# EAGLE design elm2 (EAGLE 4.16)

## Sheet 1 of 4
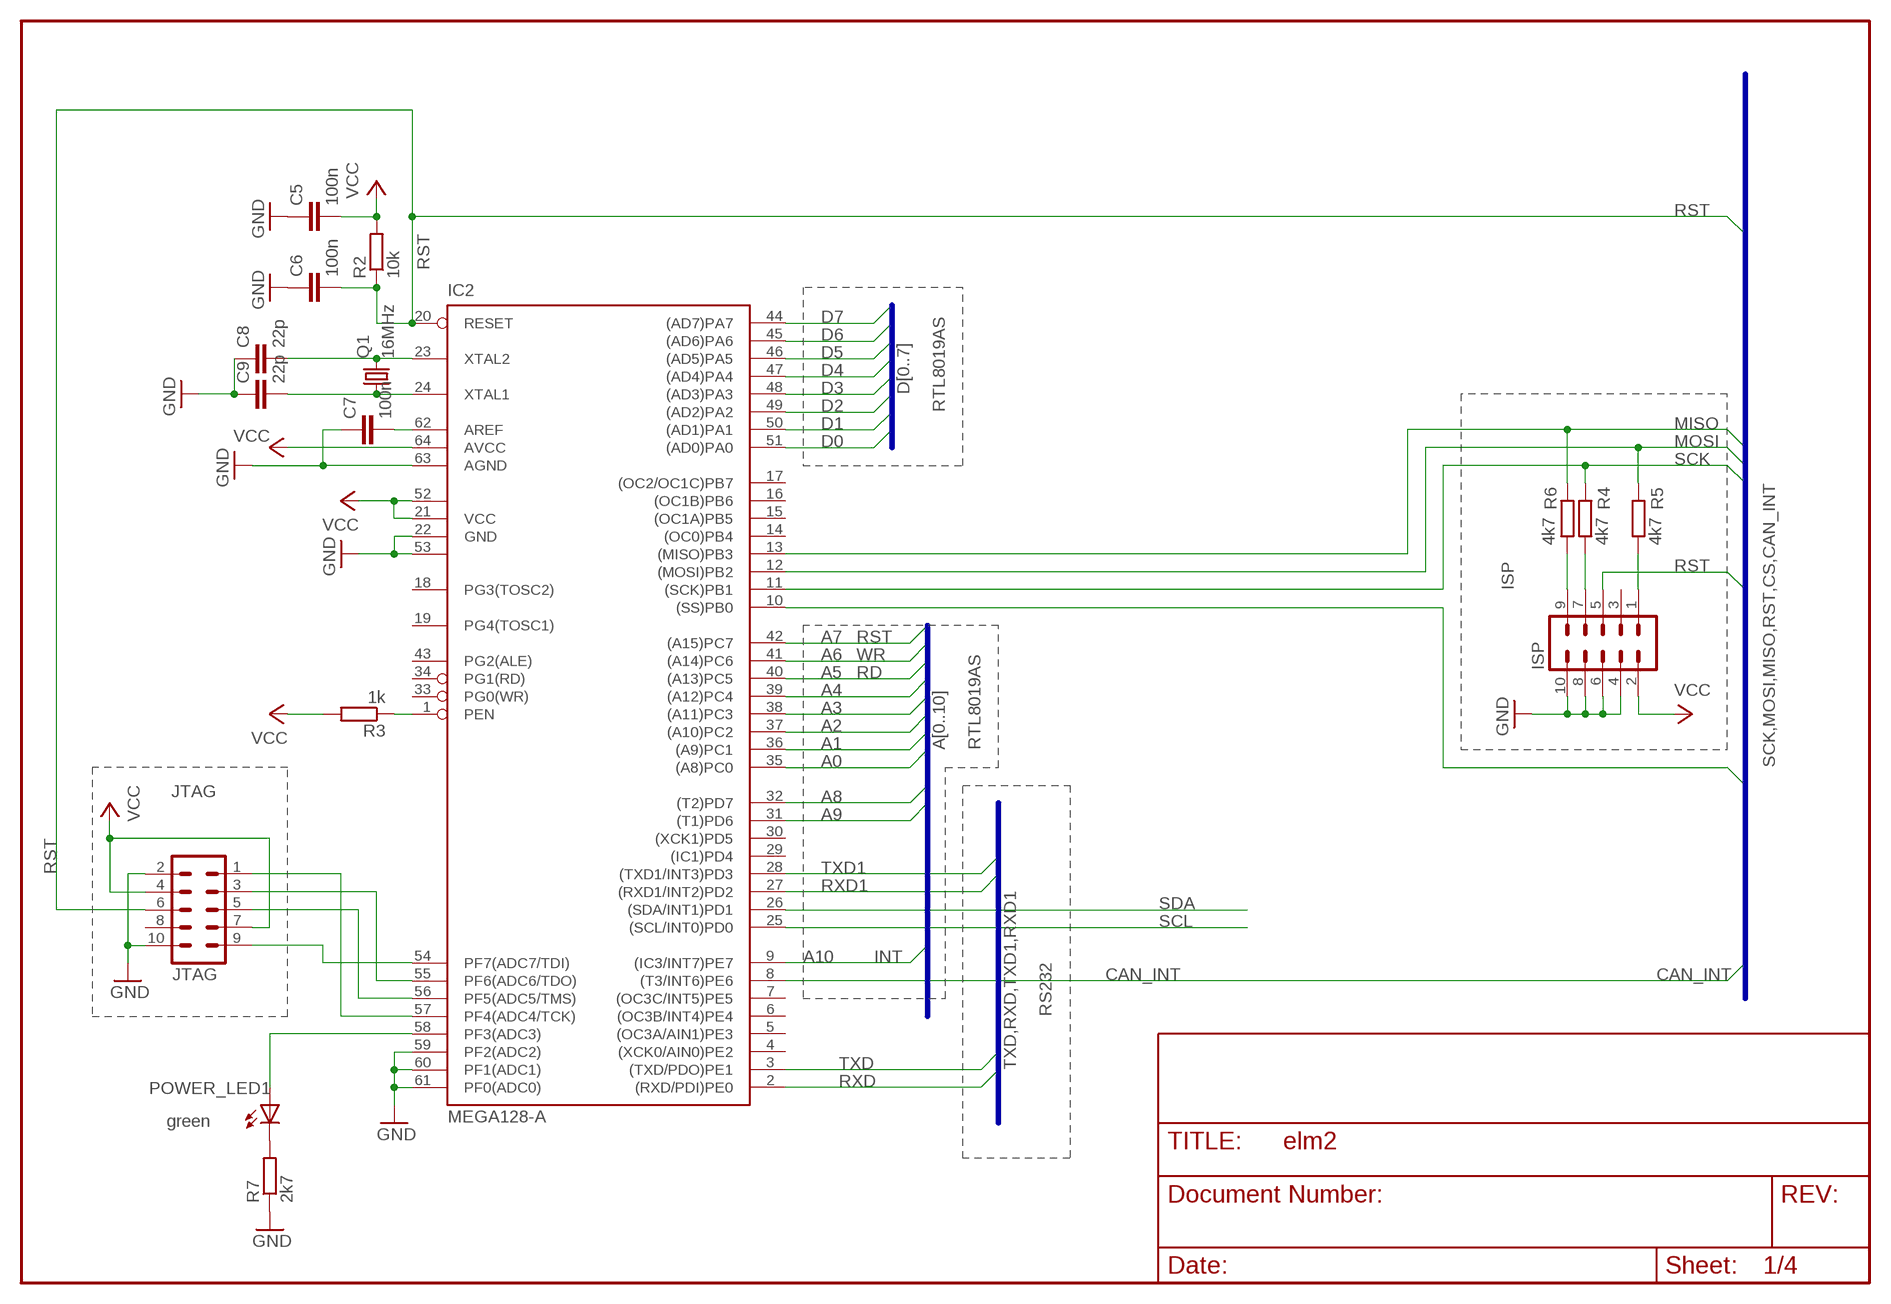
[diagram p0: schematic, sheet 1]

### Parts
C5  100n  C-EUC0603  [C0603]
C6  100n  C-EUC0603  [C0603]
C7  100n  C-EUC0603  [C0603]
C8  22p  C-EUC0603  [C0603]
C9  22p  C-EUC0603  [C0603]
IC2  MEGA128-A  [TQFP64]
ISP  MA05-2  [MA05-2]
JTAG  MA05-2  [MA05-2]
POWER_LED1  green  LED3MM  [LED3MM]
Q1  16MHz  CRYSTALHC49U-V  [HC49U-V]
R2  10k  R-EU_R0805  [R0805]
R3  1k  R-EU_R0805  [R0805]
R4  4k7  R-EU_R0805  [R0805]
R5  4k7  R-EU_R0805  [R0805]
R6  4k7  R-EU_R0805  [R0805]
R7  2k7  R-EU_R0805  [R0805]

### Nets
A0: IC2.35((A8)PC0) ; also sheet 3
A1: IC2.36((A9)PC1) ; also sheet 3
A2: IC2.37((A10)PC2) ; also sheet 3
A3: IC2.38((A11)PC3) ; also sheet 3
A4: IC2.39((A12)PC4) ; also sheet 3
A5: IC2.40((A13)PC5) ; also sheet 3
A6: IC2.41((A14)PC6) ; also sheet 3
A7: IC2.42((A15)PC7) ; also sheet 3
A8: IC2.32((T2)PD7) ; also sheet 3
A9: IC2.31((T1)PD6) ; also sheet 3
A10: IC2.9((IC3/INT7)PE7) ; also sheet 3
CAN_INT: IC2.8((T3/INT6)PE6) ; also sheet 2
CS: IC2.10((SS)PB0) ; also sheet 2
D0: IC2.51((AD0)PA0) ; also sheet 3
D1: IC2.50((AD1)PA1) ; also sheet 3
D2: IC2.49((AD2)PA2) ; also sheet 3
D3: IC2.48((AD3)PA3) ; also sheet 3
D4: IC2.47((AD4)PA4) ; also sheet 3
D5: IC2.46((AD5)PA5) ; also sheet 3
D6: IC2.45((AD6)PA6) ; also sheet 3
D7: IC2.44((AD7)PA7) ; also sheet 3
GND: C5.1 C6.1 C7.1 C8.1 C9.1 IC2.22(GND) IC2.53(GND1) IC2.59(PF2(ADC2)) IC2.60(PF1(ADC1)) IC2.61(PF0(ADC0)) IC2.63(AGND) ISP.4 ISP.6 ISP.8 ISP.10 JTAG.2 JTAG.10 R7.1 ; also sheet 2,3,4
MISO: IC2.13((MISO)PB3) R6.2 ; also sheet 2
MOSI: IC2.12((MOSI)PB2) R5.2 ; also sheet 2
N$5: C7.2 IC2.62(AREF)
N$6: C9.2 IC2.24(XTAL1) Q1.1
N$7: C8.2 IC2.23(XTAL2) Q1.2
N$22: ISP.9 R6.1
N$25: ISP.1 R5.1
N$26: IC2.1(PEN) R3.1
N$29: ISP.7 R4.1
N$31: POWER_LED1.K(C) R7.2
N$32: IC2.58(PF3(ADC3)) POWER_LED1.A
N$68: IC2.54(PF7(ADC7/TDI)) JTAG.9
N$69: IC2.55(PF6(ADC6/TDO)) JTAG.3
N$70: IC2.56(PF5(ADC5/TMS)) JTAG.5
N$71: IC2.57(PF4(ADC4/TCK)) JTAG.1
RST: C6.2 IC2.20(RESET) ISP.5 JTAG.6 R2.1 ; also sheet 2,4
RXD: IC2.2((RXD/PDI)PE0) ; also sheet 4
RXD1: IC2.27((RXD1/INT2)PD2) ; also sheet 4
SCK: IC2.11((SCK)PB1) R4.2 ; also sheet 2
SCL: IC2.25((SCL/INT0)PD0) ; also sheet 4
SDA: IC2.26((SDA/INT1)PD1) ; also sheet 4
TXD: IC2.3((TXD/PDO)PE1) ; also sheet 4
TXD1: IC2.28((TXD1/INT3)PD3) ; also sheet 4
VCC: C5.2 IC2.21(VCC) IC2.52(VCC1) IC2.64(AVCC) ISP.2 JTAG.4 JTAG.7 R2.2 R3.2 ; also sheet 2,3,4
Unconnected: IC2.4((XCK0/AIN0)PE2) IC2.5((OC3A/AIN1)PE3) IC2.6((OC3B/INT4)PE4) IC2.7((OC3C/INT5)PE5) IC2.14((OC0)PB4) IC2.15((OC1A)PB5) IC2.16((OC1B)PB6) IC2.17((OC2/OC1C)PB7) IC2.18(PG3(TOSC2)) IC2.19(PG4(TOSC1)) IC2.29((IC1)PD4) IC2.30((XCK1)PD5) IC2.33(PG0(WR)) IC2.34(PG1(RD)) IC2.43(PG2(ALE)) ISP.3 JTAG.8

### Buses
SCK,MOSI,MISO,RST,CS,CAN_INT
TXD,RXD,TXD1,RXD1
D[0..7]
A[0..10]

### Notes on the sheet
- RTL8019AS
- ISP
- RST
- WR
- RD
- RTL8019AS
- JTAG
- INT
- RS232

## Sheet 2 of 4
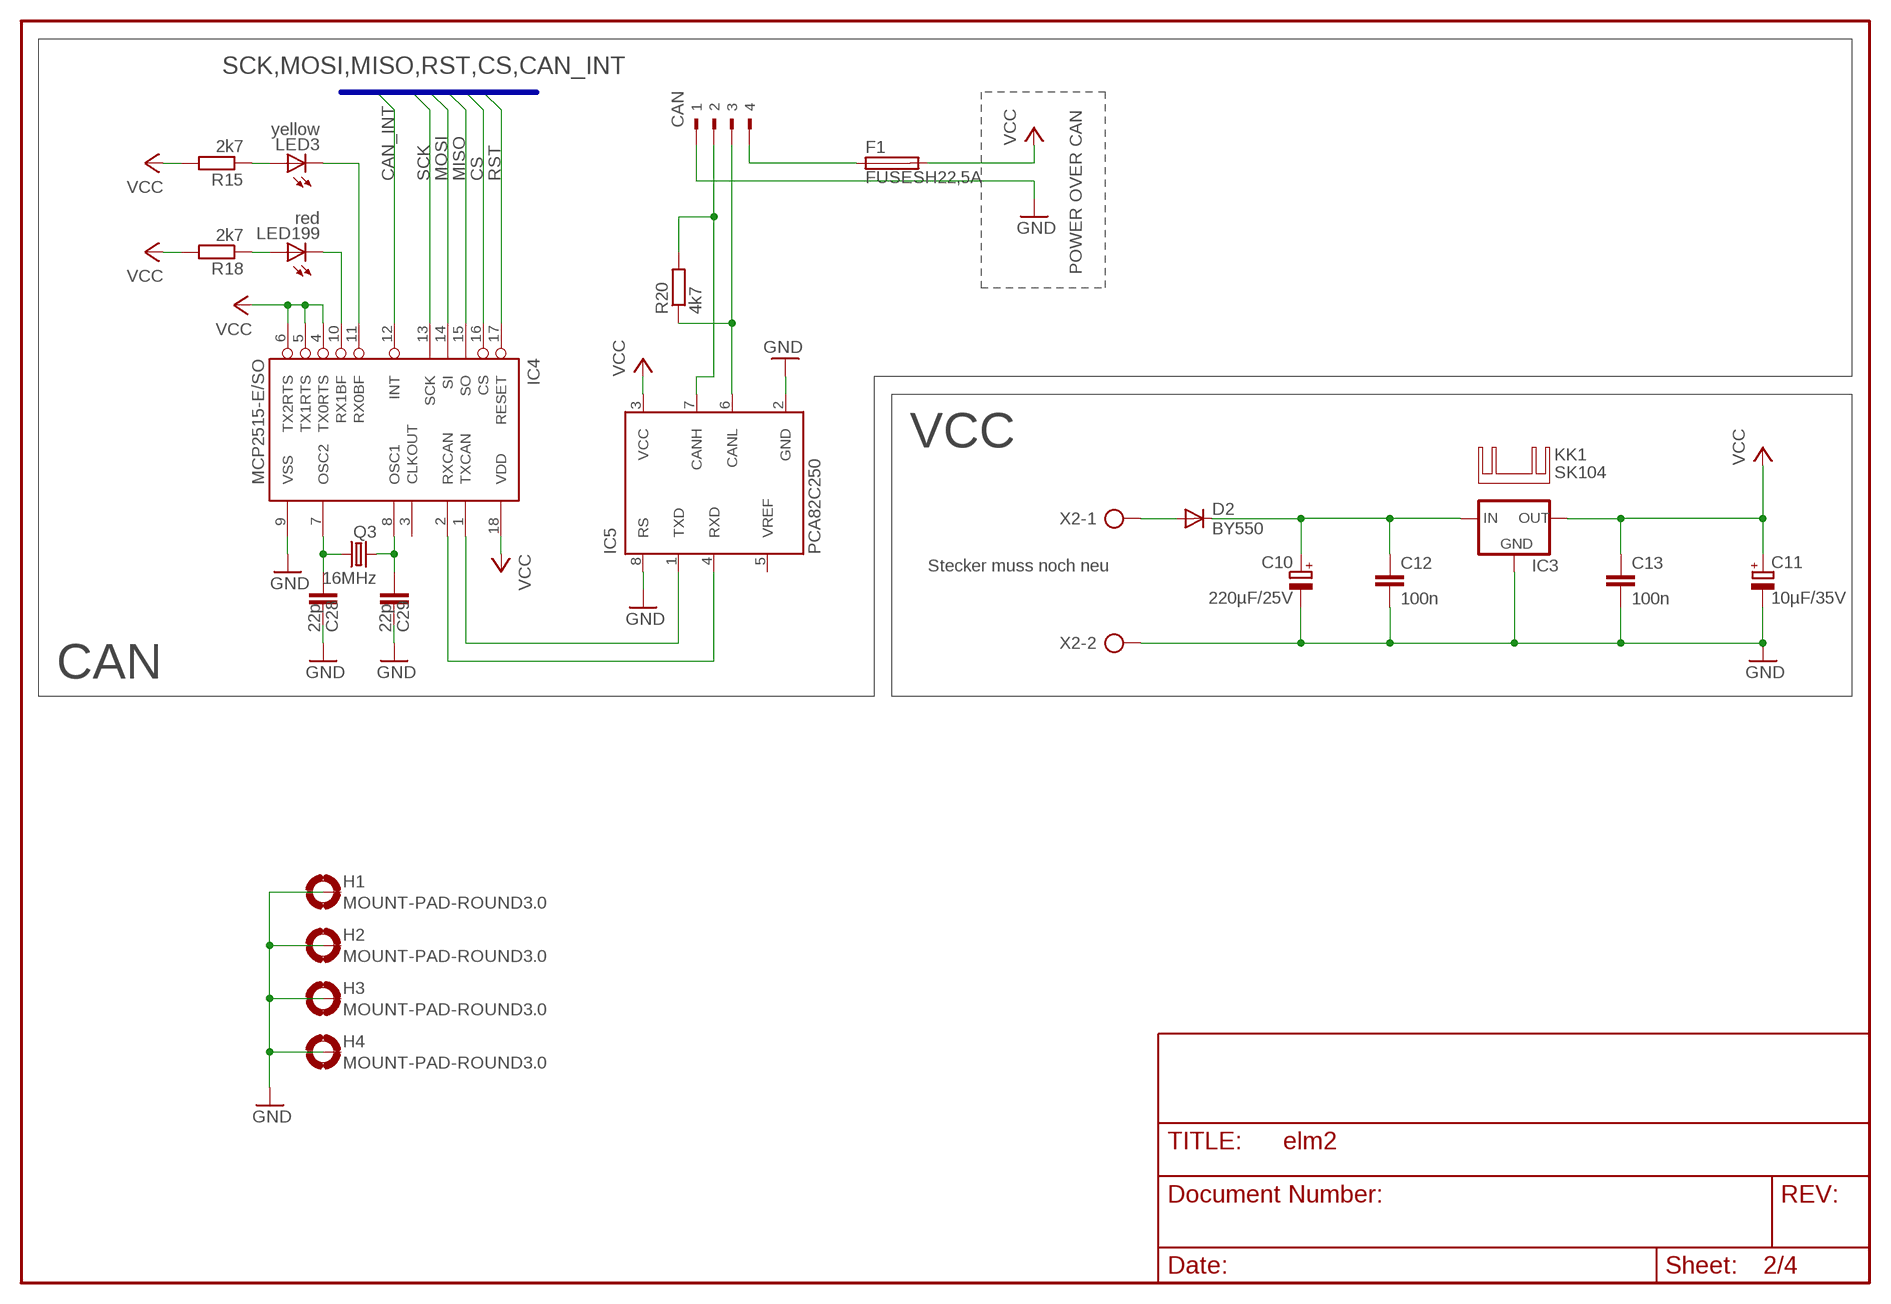
[diagram p1: schematic, sheet 2]

### Parts
C10  220µF/25V  CPOL-EUE3.5-8  [E3,5-8]
C11  10µF/35V  CPOL-EUE2-5  [E2-5]
C12  100n  C-EUC0603  [C0603]
C13  100n  C-EUC0603  [C0603]
C28  22p  C-EUC0603  [C0603]
C29  22p  C-EUC0603  [C0603]
CAN  90-4  [90-4]
D2  BY550  [DO27-15]
F1  FUSESH22,5A  [SH22,5A]
H1  MOUNT-PAD-ROUND3.0  [3,0-PAD]
H2  MOUNT-PAD-ROUND3.0  [3,0-PAD]
H3  MOUNT-PAD-ROUND3.0  [3,0-PAD]
H4  MOUNT-PAD-ROUND3.0  [3,0-PAD]
IC3  78XXS  [78XXS]
IC4  MCP2515-E/SO  [SO18L]
IC5  PCA82C250  [DIL08]
KK1  SK104  [SK104]
LED3  yellow  LED3MM  [LED3MM]
LED199  red  LED3MM  [LED3MM]
Q3  16MHz  CRYSTALHC49U-V  [HC49U-V]
R15  2k7  R-EU_R0805  [R0805]
R18  2k7  R-EU_R0805  [R0805]
R20  4k7  R-EU_R0805  [R0805]
X2  AK500/2-H  [AK500/2-H]

### Nets
CAN_INT: IC4.12(INT) ; also sheet 1
CS: IC4.16(CS) ; also sheet 1
GND: C10.- C11.- C12.2 C13.2 C28.2 C29.2 CAN.1 H1.B3,0(MOUNT) H2.B3,0(MOUNT) H3.B3,0(MOUNT) H4.B3,0(MOUNT) IC3.GND IC4.9(VSS) IC5.2(GND) IC5.8(RS) X2.2 ; also sheet 1,3,4
MISO: IC4.15(SO) ; also sheet 1
MOSI: IC4.14(SI) ; also sheet 1
N$2: IC4.1(TXCAN) IC5.1(TXD)
N$8: C10.+ C12.1 D2.C IC3.IN
N$10: D2.A X2.1
N$16: CAN.4 F1.1
N$21: IC4.2(RXCAN) IC5.4(RXD)
N$23: CAN.3 IC5.6(CANL) R20.1
N$27: IC4.11(RX0BF) LED3.K(C)
N$38: IC4.10(RX1BF) LED199.K(C)
N$48: LED3.A R15.1
N$52: LED199.A R18.1
N$53: C28.1 IC4.7(OSC2) Q3.1
N$54: C29.1 IC4.8(OSC1) Q3.2
N$59: CAN.2 IC5.7(CANH) R20.2
RST: IC4.17(RESET) ; also sheet 1,4
SCK: IC4.13(SCK) ; also sheet 1
VCC: C11.+ C13.1 F1.2 IC3.OUT IC4.4(TX0RTS) IC4.5(TX1RTS) IC4.6(TX2RTS) IC4.18(VDD) IC5.3(VCC) R15.2 R18.2 ; also sheet 1,3,4
Unconnected: IC4.3(CLKOUT) IC5.5(VREF)

### Buses
SCK,MOSI,MISO,RST,CS,CAN_INT

### Notes on the sheet
- POWER OVER CAN
- VCC
- Stecker muss noch neu
- CAN

## Sheet 3 of 4
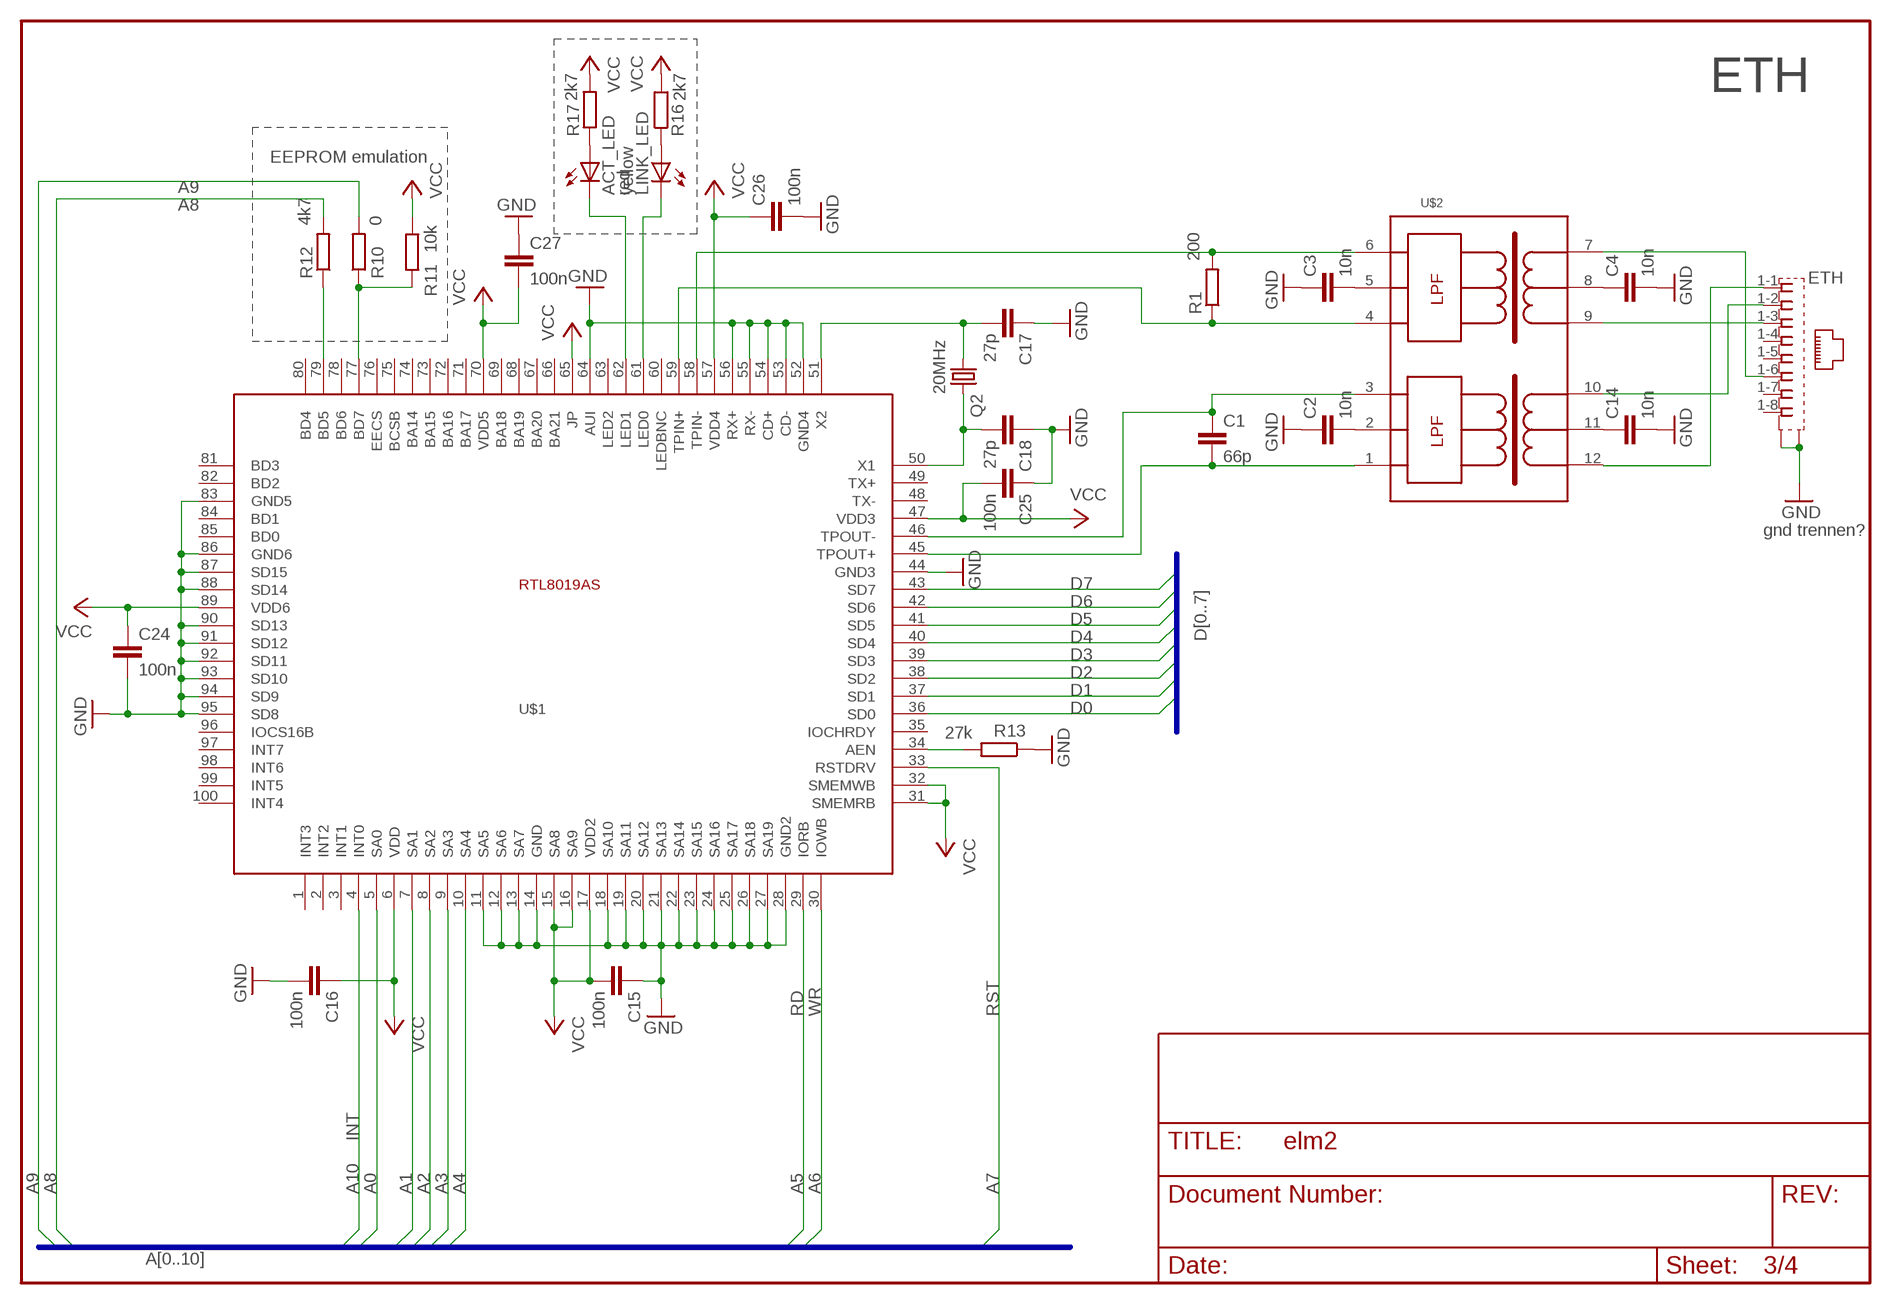
[diagram p2: schematic, sheet 3]

### Parts
ACT_LED  red  LED3MM  [LED3MM]
C1  66p  C-EUC0603  [C0603]
C2  10n  C-EUC0603  [C0603]
C3  10n  C-EUC0603  [C0603]
C4  10n  C-EUC0603  [C0603]
C14  10n  C-EUC0603  [C0603]
C15  100n  C-EUC0603  [C0603]
C16  100n  C-EUC0603  [C0603]
C17  27p  C-EUC0603  [C0603]
C18  27p  C-EUC0603  [C0603]
C24  100n  C-EUC0603  [C0603]
C25  100n  C-EUC0603  [C0603]
C26  100n  C-EUC0603  [C0603]
C27  100n  C-EUC0603  [C0603]
ETH  557786-1  [557786-1]
LINK_LED  yellow  LED3MM  [LED3MM]
Q2  20MHz  CRYSTALHC49U-V  [HC49U-V]
R1  200  R-EU_R0805  [R0805]
R10  0  R-EU_R0805  [R0805]
R11  10k  R-EU_R0805  [R0805]
R12  4k7  R-EU_R0805  [R0805]
R13  27k  R-EU_R0805  [R0805]
R16  2k7  R-EU_R0805  [R0805]
R17  2k7  R-EU_R0805  [R0805]
U$1  RTL8019AS  [RTL8019AS]
U$2  20F001  [DIL16/12]

### Nets
A0: U$1.5(SA0) ; also sheet 1
A1: U$1.7(SA1) ; also sheet 1
A2: U$1.8(SA2) ; also sheet 1
A3: U$1.9(SA3) ; also sheet 1
A4: U$1.10(SA4) ; also sheet 1
A5: U$1.29(IORB) ; also sheet 1
A6: U$1.30(IOWB) ; also sheet 1
A7: U$1.33(RSTDRV) ; also sheet 1
A8: R12.2 ; also sheet 1
A9: R10.2 ; also sheet 1
A10: U$1.4(INT0) ; also sheet 1
D0: U$1.36(SD0) ; also sheet 1
D1: U$1.37(SD1) ; also sheet 1
D2: U$1.38(SD2) ; also sheet 1
D3: U$1.39(SD3) ; also sheet 1
D4: U$1.40(SD4) ; also sheet 1
D5: U$1.41(SD5) ; also sheet 1
D6: U$1.42(SD6) ; also sheet 1
D7: U$1.43(SD7) ; also sheet 1
GND: C2.1 C3.1 C4.2 C14.2 C15.1 C16.2 C17.1 C18.1 C24.2 C25.1 C26.2 C27.1 ETH.G1(S2) ETH.G2(S1) R13.1 U$1.11(SA5) U$1.12(SA6) U$1.13(SA7) U$1.14(GND) U$1.18(SA10) U$1.19(SA11) U$1.20(SA12) U$1.21(SA13) U$1.22(SA14) U$1.23(SA15) U$1.24(SA16) U$1.25(SA17) U$1.26(SA18) U$1.27(SA19) U$1.28(GND2) U$1.44(GND3) U$1.52(GND4) U$1.53(CD-) U$1.54(CD+) U$1.55(RX-) U$1.56(RX+) U$1.64(AUI) U$1.83(GND5) U$1.86(GND6) U$1.87(SD15) U$1.88(SD14) U$1.90(SD13) U$1.91(SD12) U$1.92(SD11) U$1.93(SD10) U$1.94(SD9) U$1.95(SD8) ; also sheet 1,2,4
N$1: R1.2 U$1.58(TPIN-) U$2.6
N$3: R1.1 U$1.59(TPIN+) U$2.4
N$4: C1.1 U$1.46(TPOUT-) U$2.3
N$11: C1.2 U$1.45(TPOUT+) U$2.1
N$12: C3.2 U$2.5
N$13: C2.2 U$2.2
N$14: C14.1 U$2.11
N$15: C4.1 U$2.8
N$18: ETH.1-1 U$2.12
N$19: ETH.1-2 U$2.10
N$20: ETH.1-3 U$2.9
N$24: ETH.1-6 U$2.7
N$28: LINK_LED.A R16.1
N$34: C17.2 Q2.2 U$1.51(X2)
N$35: C18.2 Q2.1 U$1.50(X1)
N$36: R10.1 R11.2 U$1.77(BD7)
N$37: R12.1 U$1.79(BD5)
N$39: R13.2 U$1.34(AEN)
N$44: ACT_LED.A R17.1
N$45: LINK_LED.K(C) U$1.61(LED0)
N$47: ACT_LED.K(C) U$1.62(LED1)
VCC: C15.2 C16.1 C24.1 C25.2 C26.1 C27.2 R11.1 R16.2 R17.2 U$1.6(VDD) U$1.15(SA8) U$1.16(SA9) U$1.17(VDD2) U$1.31(SMEMRB) U$1.32(SMEMWB) U$1.47(VDD3) U$1.57(VDD4) U$1.65(JP) U$1.70(VDD5) U$1.89(VDD6) ; also sheet 1,2,4
Unconnected: ETH.1-4 ETH.1-5 ETH.1-7 ETH.1-8 U$1.1(INT3) U$1.2(INT2) U$1.3(INT1) U$1.35(IOCHRDY) U$1.48(TX-) U$1.49(TX+) U$1.60(LEDBNC) U$1.63(LED2) U$1.66(BA21) U$1.67(BA20) U$1.68(BA19) U$1.69(BA18) U$1.71(BA17) U$1.72(BA16) U$1.73(BA15) U$1.74(BA14) U$1.75(BCSB) U$1.76(EECS) U$1.78(BD6) U$1.80(BD4) U$1.81(BD3) U$1.82(BD2) U$1.84(BD1) U$1.85(BD0) U$1.96(IOCS16B) U$1.97(INT7) U$1.98(INT6) U$1.99(INT5) U$1.100(INT4)

### Buses
D[0..7]
A[0..10]

### Notes on the sheet
- ETH
- EEPROM emulation
- gnd trennen?
- RD | WR | RST
- INT

## Sheet 4 of 4
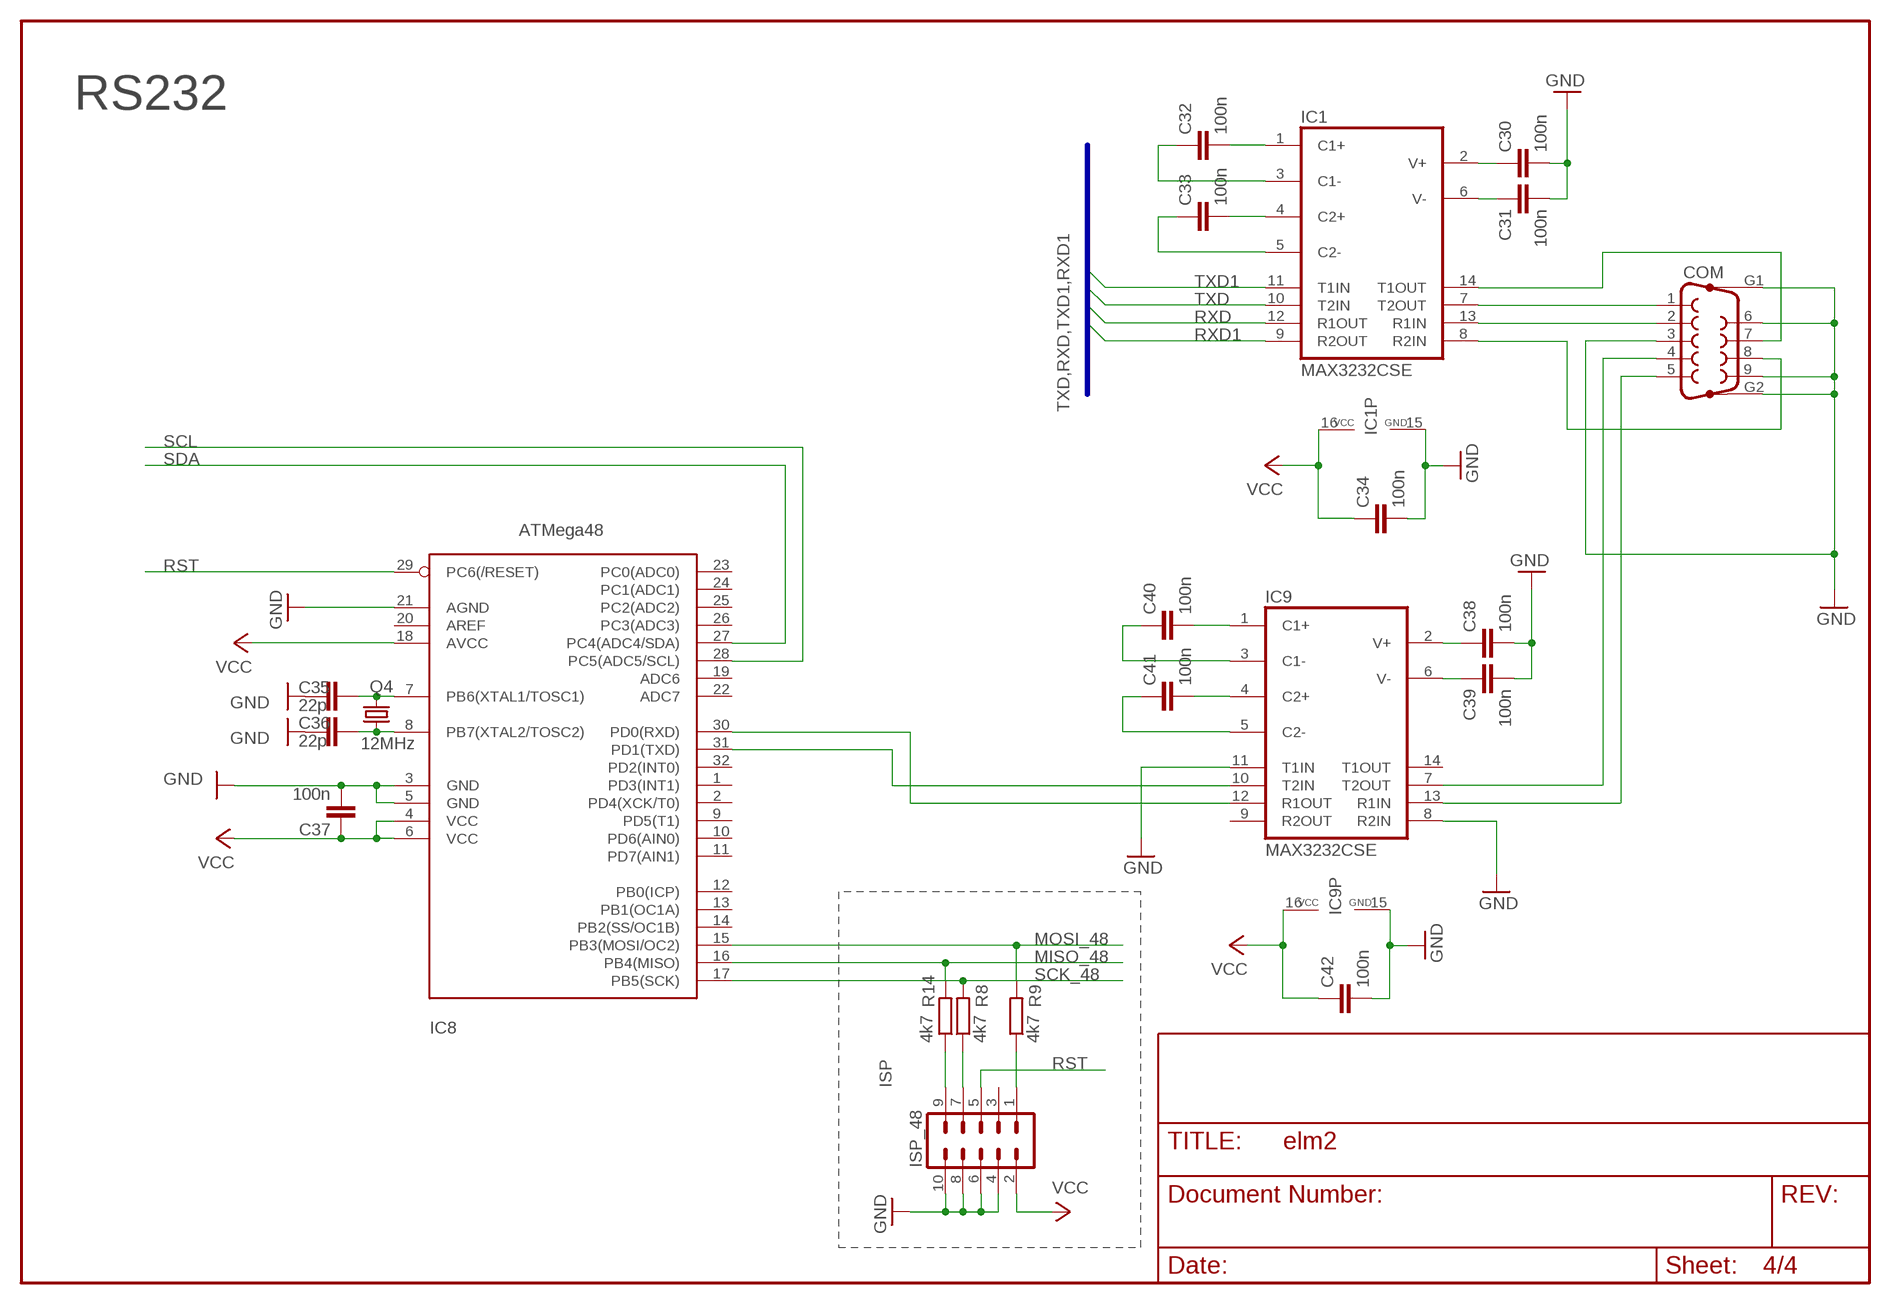
[diagram p3: schematic, sheet 4]

### Parts
C30  100n  C-EUC0603  [C0603]
C31  100n  C-EUC0603  [C0603]
C32  100n  C-EUC0603  [C0603]
C33  100n  C-EUC0603  [C0603]
C34  100n  C-EUC0603  [C0603]
C35  22p  C-EUC0603  [C0603]
C36  22p  C-EUC0603  [C0603]
C37  100n  C-EUC0603  [C0603]
C38  100n  C-EUC0603  [C0603]
C39  100n  C-EUC0603  [C0603]
C40  100n  C-EUC0603  [C0603]
C41  100n  C-EUC0603  [C0603]
C42  100n  C-EUC0603  [C0603]
COM  F09HP  [F09HP]
IC1  MAX3232CSE  [SO16]
IC8  ATMega48  MEGA8-AI  [TQFP32-08]
IC9  MAX3232CSE  [SO16]
ISP_48  MA05-2  [MA05-2]
Q4  12MHz  CRYTALHC49S  [HC49/S]
R8  4k7  R-EU_R0805  [R0805]
R9  4k7  R-EU_R0805  [R0805]
R14  4k7  R-EU_R0805  [R0805]

### Nets
GND: C30.2 C31.2 C34.2 C35.1 C36.2 C37.2 C38.2 C39.2 C42.2 COM.3 COM.6 COM.9 COM.G1 COM.G2 IC1.15(GND) IC8.3(GND) IC8.5(GND) IC8.21(AGND) IC9.8(R2IN) IC9.11(T1IN) IC9.15(GND) ISP_48.4 ISP_48.6 ISP_48.8 ISP_48.10 ; also sheet 1,2,3
MISO_48: IC8.16(PB4(MISO)) R14.2
MOSI_48: IC8.15(PB3(MOSI/OC2)) R9.2
N$9: COM.1 IC1.7(T2OUT)
N$17: ISP_48.9 R14.1
N$30: ISP_48.1 R9.1
N$33: COM.2 IC1.13(R1IN)
N$40: ISP_48.7 R8.1
N$60: C32.2 IC1.1(C1+)
N$61: C33.2 IC1.4(C2+)
N$72: C33.1 IC1.5(C2-)
N$73: C32.1 IC1.3(C1-)
N$74: COM.7 IC1.14(T1OUT)
N$75: COM.8 IC1.8(R2IN)
N$76: C30.1 IC1.2(V+)
N$77: C31.1 IC1.6(V-)
N$78: COM.4 IC9.7(T2OUT)
N$79: C35.2 IC8.7(PB6(XTAL1/TOSC1)) Q4.2
N$80: C36.1 IC8.8(PB7(XTAL2/TOSC2)) Q4.1
N$82: COM.5 IC9.13(R1IN)
N$83: C40.2 IC9.1(C1+)
N$84: C41.2 IC9.4(C2+)
N$85: C41.1 IC9.5(C2-)
N$86: C40.1 IC9.3(C1-)
N$87: IC8.30(PD0(RXD)) IC9.12(R1OUT)
N$88: IC8.31(PD1(TXD)) IC9.10(T2IN)
N$89: C38.1 IC9.2(V+)
N$90: C39.1 IC9.6(V-)
RST: IC8.29(PC6(/RESET)) ISP_48.5 ; also sheet 1,2
RXD: IC1.12(R1OUT) ; also sheet 1
RXD1: IC1.9(R2OUT) ; also sheet 1
SCK_48: IC8.17(PB5(SCK)) R8.2
SCL: IC8.28(PC5(ADC5/SCL)) ; also sheet 1
SDA: IC8.27(PC4(ADC4/SDA)) ; also sheet 1
TXD: IC1.10(T2IN) ; also sheet 1
TXD1: IC1.11(T1IN) ; also sheet 1
VCC: C34.1 C37.1 C42.1 IC1.16(VCC) IC8.4(VCC) IC8.6(VCC) IC8.18(AVCC) IC9.16(VCC) ISP_48.2 ; also sheet 1,2,3
Unconnected: IC8.1(PD3(INT1)) IC8.2(PD4(XCK/T0)) IC8.9(PD5(T1)) IC8.10(PD6(AIN0)) IC8.11(PD7(AIN1)) IC8.12(PB0(ICP)) IC8.13(PB1(OC1A)) IC8.14(PB2(SS/OC1B)) IC8.19(ADC6) IC8.20(AREF) IC8.22(ADC7) IC8.23(PC0(ADC0)) IC8.24(PC1(ADC1)) IC8.25(PC2(ADC2)) IC8.26(PC3(ADC3)) IC8.32(PD2(INT0)) IC9.9(R2OUT) IC9.14(T1OUT) ISP_48.3

### Buses
TXD,RXD,TXD1,RXD1

### Notes on the sheet
- RS232
- ISP

## Library data of the parts
ACT_LED LED3 LED199 LINK_LED POWER_LED1 = led:LED: LED OSRAM: - CHIPLED LG R971, LG N971, LY N971, LG Q971, LY Q971, LO R971, LY R971 LH N974, LH R974 LS Q976, LO Q976, LY Q976 LO Q996 - Hyper CHIPLED LW Q18S LB Q993, LB Q99A, LB R99A - SideLED LS A670, LO A670, LY A670, LG A670, LP A670 LB A673, LV A673, LT A673, LW A673 LH A674 LY A675 LS A676, LA A676, LO A676, LY A676, LW A676 LS A679, LY A679, LG A679 - Hyper Micro SIDELED® LS Y876, LA Y876, LO Y876, LY Y876 LT Y87S - SmartLED LW L88C, LW L88S LB L89C, LB L89S, LG L890 LS L89K, LO L89K, LY L89K LS L896, LA L896, LO L896, LY L896 - TOPLED LS T670, LO T670, LY T670, LG T670, LP T670 LSG T670, LSP T670, LSY T670, LOP T670, LYG T670 LG T671, LOG T671, LSG T671 LB T673, LV T673, LT T673, LW T673 LH T674 LS T676, LA T676, LO T676, LY T676, LB T676, LH T676, LSB T676, LW T676 LB T67C, LV T67C, LT T67C, LS T67K, LO T67K, LY T67K, LW E67C LS E67B, LA E67B, LO E67B, LY E67B, LB E67C, LV E67C, LT E67C LW T67C LS T679, LY T679, LG T679 LS T770, LO T770, LY T770, LG T770, LP T770 LB T773, LV T773, LT T773, LW T773 LH T774 LS E675, LA E675, LY E675, LS T675 LS T776, LA T776, LO T776, LY T776, LB T776 LHGB T686 LT T68C, LB T68C - Hyper Mini TOPLED® LB M676 - Mini TOPLED Santana® LG M470 LS M47K, LO M47K, LY M47K Source: http://www.osram.convergy.de - LUMILED® LXK2-PW12-R00, LXK2-PW12-S00, LXK2-PW14-U00, LXK2-PW14-V00 LXK2-PM12-R00, LXK2-PM12-S00, LXK2-PM14-U00 LXK2-PE12-Q00, LXK2-PE12-R00, LXK2-PE12-S00, LXK2-PE14-T00, LXK2-PE14-U00 LXK2-PB12-K00, LXK2-PB12-L00, LXK2-PB12-M00, LXK2-PB14-N00, LXK2-PB14-P00, LXK2-PB14-Q00 LXK2-PR12-L00, LXK2-PR12-M00, LXK2-PR14-Q00, LXK2-PR14-R00 LXK2-PD12-Q00, LXK2-PD12-R00, LXK2-PD12-S00 LXK2-PH12-R00, LXK2-PH12-S00 LXK2-PL12-P00, LXK2-PL12-Q00, LXK2-PL12-R00 Source: www.luxeon.com
C1-C9 C12-C18 C24-C42 = rcl:C-EU: CAPACITOR, European symbol
C10 C11 = rcl:CPOL-EU: POLARIZED CAPACITOR, European symbol
CAN = con-weidmueller-sl35:90-4: WEIDMUELLER CLAMP CONNECTOR
COM = con-subd:F09HP: SUB-D
D2 = diode:BY550: DIODE Si200 V, 5 A
ETH = con-amp:557786-1: AMP connector
F1 = fuse:FUSE: Fuse
H1-H4 = holes:MOUNT-PAD-ROUND: MOUNTING PAD, round
IC1 IC9 = maxim:MAX3232*: True RS-232 Transceivers 3.0V to 5.5V, Low-Power up to 1Mbps, Using Four 0.1µF External Capacitors Source: http://pdfserv.maxim-ic.com/en/ds/MAX3222-MAX3241.pdf
IC2 = atmel:MEGA128: MICROCONTROLLER 128 Kbytes FLASH 4 Kbytes SRAM 4 Kbytes EEPROM DUAL USART 8-channel 10 bit ADC Source: avr.lbr
IC3 = v-reg:78XXS: VOLTAGE REGULATOR
IC4 = mcp2515:MCP2515
IC5 = micro-philips:PCA82C250: CAN CONTROLLER INTERFACE
IC8 = atmel:MEGA8: MICROCONTROLLER 8 Kbytes FLASH 1 kbytes SRAM 512 bytes EEPROM USART 6-channel 10 bit ADC 2-channel 8 bit ADC Source: avr.lbr
ISP ISP_48 JTAG = con-lstb:MA05-2: PIN HEADER
KK1 = heatsink:SK104: HEATSINK manufacturer Fischer/distributor Buerklin
Q1-Q3 = crystal:CRYSTAL: CRYSTAL
Q4 = crystal:CRYTAL: CRYSTAL
R1-R18 R20 = rcl:R-EU_: RESISTOR, European symbol
U$1 = rtl8019as:RTL8019AS
U$2 = Realtek:20F001
X2 = con-ptr500:AK500/2-H: CONNECTOR Aug. 2004 / PTR Meßtechnik: Die Bezeichnung der Serie AK505 wurde geändert. Es handelt sich hierbei um AK500 in horizontaler Ausführung.

## Board
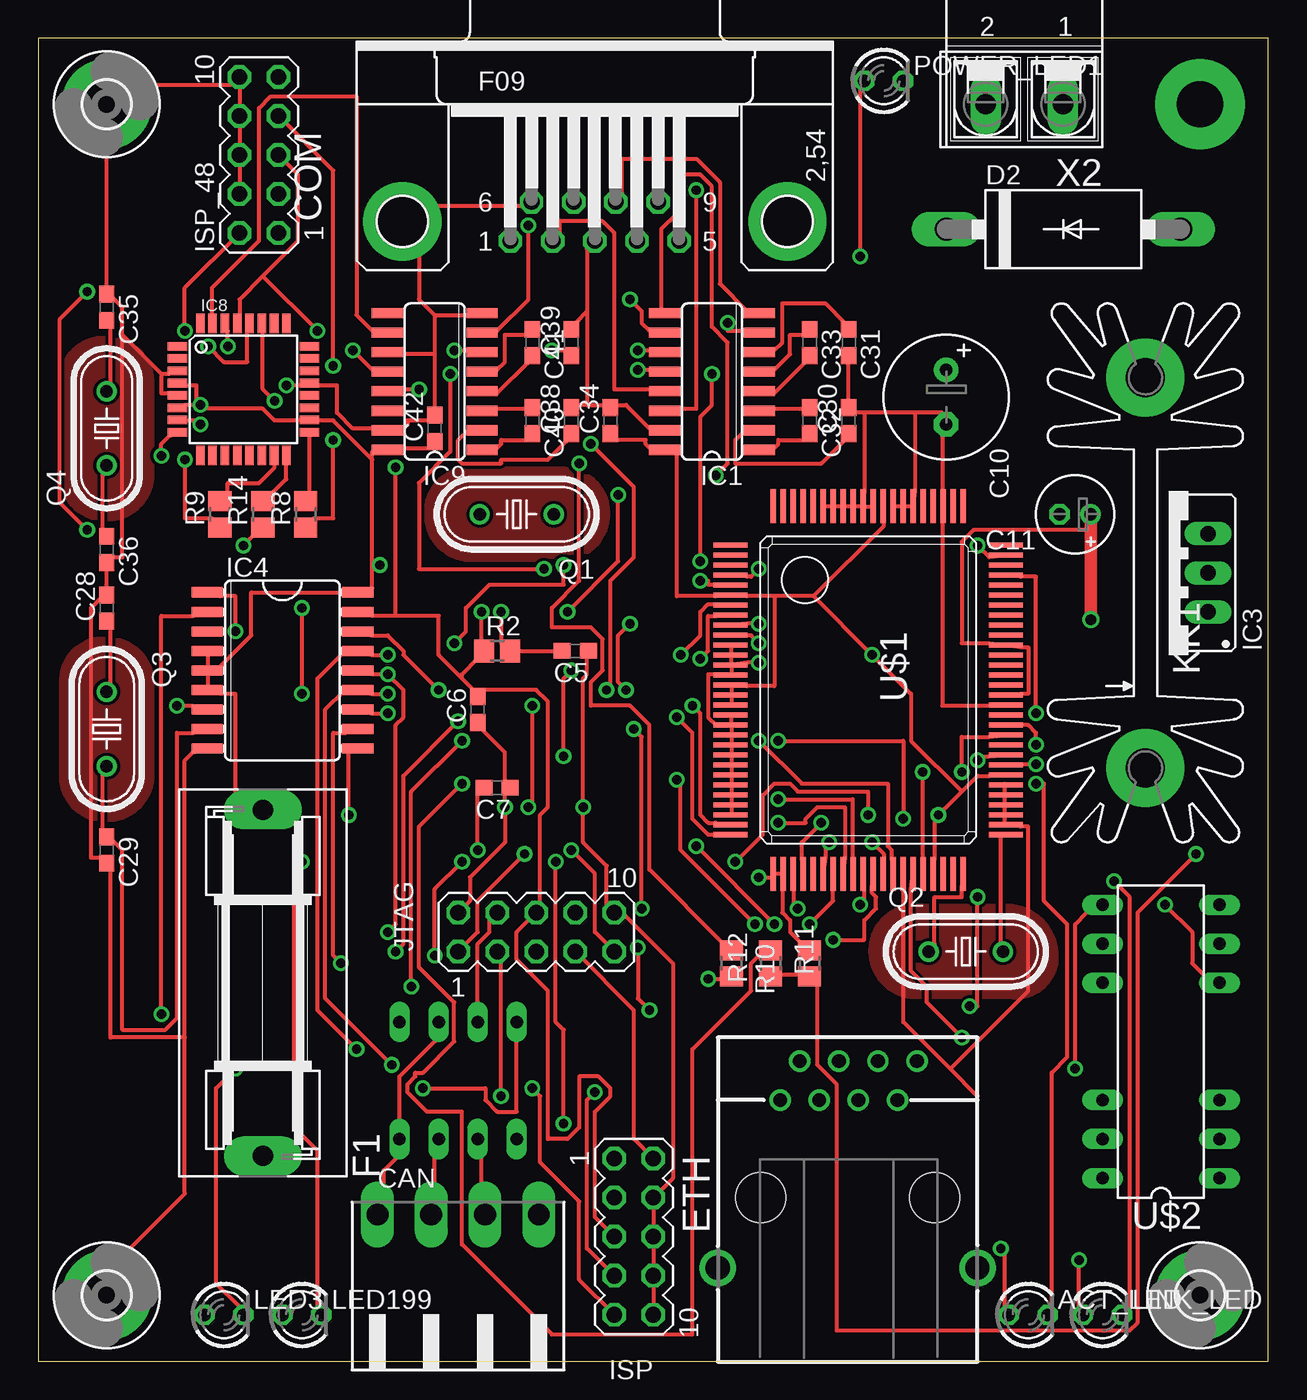
[diagram p4: board, top side]
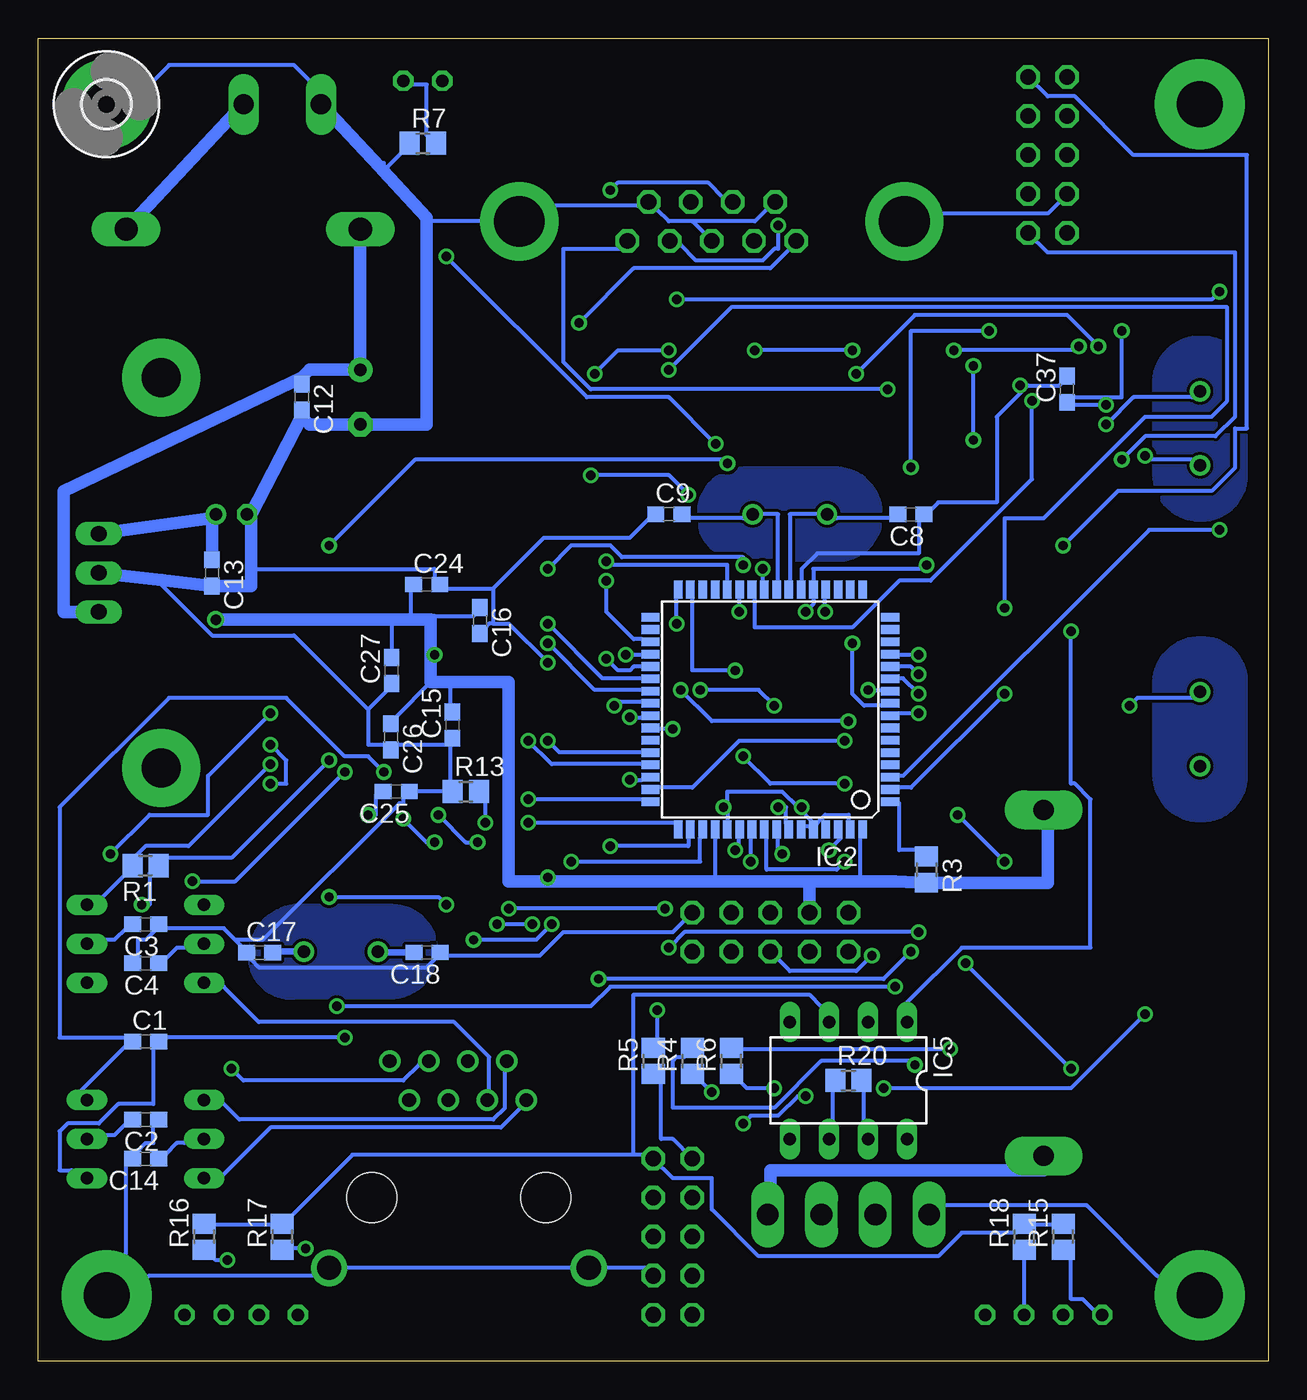
[diagram p5: board, bottom side, seen from below]

Size 79.99 x 86.03 mm. Coordinates in mm from the lower left corner, seen from the top.
Outline: 0,0 79.99,0 79.99,86.03 0,86.03 0,0
Copper layers (1*16): Top 0.035mm / dielectric 1.5mm / Bottom 0.035mm
Design rules "olimex_8mils": minimum track width 10mil, minimum drill 24mil, track to track 8mil, track to pad 8mil, pad to pad 8mil, via to via 8mil, smd to smd 8mil, copper to edge 40mil, drill to drill 10mil, minimum pad ring 10mil, minimum via ring 8mil, stop-mask expansion 0mil, vias tented up to drill 0mil, thermal gap 10mil

### Footprints (pad centres in the part's own frame; a part is rotated, then mirrored left to right if it is on the bottom)
LED3MM = drill 0.813 octagon: A -1.27,0; K 1.27,0
C0603 = smd 1.1 x 1: 1 -0.85,0; 2 0.85,0
E3,5-8 = drill 0.813 pad 1.6 round: + -1.778,0 | drill 0.813 pad 1.6 octagon: - 1.778,0
E2-5 = drill 0.813 pad 1.27 round: + -1.016,0 | drill 0.813 pad 1.27 octagon: - 1.016,0
90-4 = drill 1.422 long: 1 -5.25,5.25; 2 -1.75,5.25; 3 1.75,5.25; 4 5.25,5.25
F09HP = drill 1.016 octagon: 1 -5.486,-1.27; 2 -2.743,-1.27; 3 0,-1.27; 4 2.743,-1.27; 5 5.486,-1.27; 6 -4.115,1.27; 7 -1.372,1.27; 8 1.372,1.27; 9 4.115,1.27 | drill 3.302 pad 5.08 round: G1 -12.522,0; G2 12.522,0
DO27-15 = drill 1.499 long: A 7.62,0; C -7.62,0
557786-1 = drill 0.889 round: 1-1 -4.445,6.35; 1-2 -3.175,8.89; 1-3 -1.905,6.35; 1-4 -0.635,8.89; 1-5 0.635,6.35; 1-6 1.905,8.89; 1-7 3.175,6.35; 1-8 4.445,8.89 | drill 1.575 pad 2.184 round: G1 -8.509,-4.572; G2 8.382,-4.572 | hole 3.251: -5.715,0; 5.588,0
SH22,5A = drill 1.321 pad 2.54 long: 1 -11.252,0; 2 11.252,0
3,0-PAD = drill 3 pad 5.842 round: B3,0 0,0
SO16 = smd 0.66 x 2.032: 1 -4.445,-3.073; 2 -3.175,-3.073; 3 -1.905,-3.073; 4 -0.635,-3.073; 5 0.635,-3.073; 6 1.905,-3.073; 7 3.175,-3.073; 8 4.445,-3.073; 9 4.445,3.073; 10 3.175,3.073; 11 1.905,3.073; 12 0.635,3.073; 13 -0.635,3.073; 14 -1.905,3.073; 15 -3.175,3.073; 16 -4.445,3.073
TQFP64 = smd 1.194 x 0.559: 1 -7.8,6; 2 -7.8,5.2; 3 -7.8,4.4; 4 -7.8,3.6; 5 -7.8,2.8; 6 -7.8,2; 7 -7.8,1.2; 8 -7.8,0.4; 9 -7.8,-0.4; 10 -7.8,-1.2; 11 -7.8,-2; 12 -7.8,-2.8; 13 -7.8,-3.6; 14 -7.8,-4.4; 15 -7.8,-5.2; 16 -7.8,-6; 33 7.8,-6; 34 7.8,-5.2; 35 7.8,-4.4; 36 7.8,-3.6; 37 7.8,-2.8; 38 7.8,-2; 39 7.8,-1.2; 40 7.8,-0.4; 41 7.8,0.4; 42 7.8,1.2; 43 7.8,2; 44 7.8,2.8; 45 7.8,3.6; 46 7.8,4.4; 47 7.8,5.2; 48 7.8,6 | smd 0.559 x 1.194: 17 -6,-7.8; 18 -5.2,-7.8; 19 -4.4,-7.8; 20 -3.6,-7.8; 21 -2.8,-7.8; 22 -2,-7.8; 23 -1.2,-7.8; 24 -0.4,-7.8; 25 0.4,-7.8; 26 1.2,-7.8; 27 2,-7.8; 28 2.8,-7.8; 29 3.6,-7.8; 30 4.4,-7.8; 31 5.2,-7.8; 32 6,-7.8; 49 6,7.8; 50 5.2,7.8; 51 4.4,7.8; 52 3.6,7.8; 53 2.8,7.8; 54 2,7.8; 55 1.2,7.8; 56 0.4,7.8; 57 -0.4,7.8; 58 -1.2,7.8; 59 -2,7.8; 60 -2.8,7.8; 61 -3.6,7.8; 62 -4.4,7.8; 63 -5.2,7.8; 64 -6,7.8
78XXS = drill 1.016 long: GND 0,-2.54; IN -2.54,-2.54; OUT 2.54,-2.54
SO18L = smd 0.66 x 2.032: 1 -5.08,-4.902; 2 -3.81,-4.902; 3 -2.54,-4.902; 4 -1.27,-4.902; 5 0,-4.902; 6 1.27,-4.902; 7 2.54,-4.902; 8 3.81,-4.902; 9 5.08,-4.902; 10 5.08,4.902; 11 3.81,4.902; 12 2.54,4.902; 13 1.27,4.902; 14 0,4.902; 15 -1.27,4.902; 16 -2.54,4.902; 17 -3.81,4.902; 18 -5.08,4.902
DIL08 = drill 0.813 long: 1 -3.81,-3.81; 2 -1.27,-3.81; 3 1.27,-3.81; 4 3.81,-3.81; 5 3.81,3.81; 6 1.27,3.81; 7 -1.27,3.81; 8 -3.81,3.81
TQFP32-08 = smd 1.27 x 0.559: 1 -4.293,2.8; 2 -4.293,2; 3 -4.293,1.2; 4 -4.293,0.4; 5 -4.293,-0.4; 6 -4.293,-1.2; 7 -4.293,-2; 8 -4.293,-2.8; 17 4.293,-2.8; 18 4.293,-2; 19 4.293,-1.2; 20 4.293,-0.4; 21 4.293,0.4; 22 4.293,1.2; 23 4.293,2; 24 4.293,2.8 | smd 0.559 x 1.27: 9 -2.8,-4.293; 10 -2,-4.293; 11 -1.2,-4.293; 12 -0.4,-4.293; 13 0.4,-4.293; 14 1.2,-4.293; 15 2,-4.293; 16 2.8,-4.293; 25 2.8,4.293; 26 2,4.293; 27 1.2,4.293; 28 0.4,4.293; 29 -0.4,4.293; 30 -1.2,4.293; 31 -2,4.293; 32 -2.8,4.293
MA05-2 = drill 1.016 octagon: 1 -5.08,-1.27; 2 -5.08,1.27; 3 -2.54,-1.27; 4 -2.54,1.27; 5 0,-1.27; 6 0,1.27; 7 2.54,-1.27; 8 2.54,1.27; 9 5.08,-1.27; 10 5.08,1.27
SK104 = drill 2.54 pad 5.08 round: A2,5 -12.7,-0.762; B2,5 12.7,-0.762
HC49U-V = drill 0.813 round: 1 -2.413,0; 2 2.413,0
HC49/S = drill 0.813 round: 1 -2.413,0; 2 2.413,0
R0805 = smd 1.3 x 1.5: 1 -0.85,0; 2 0.85,0
RTL8019AS = smd 0.35 x 2.2: 1 -9.425,-8.965; 2 -8.775,-8.965; 3 -8.125,-8.965; 4 -7.475,-8.965; 5 -6.825,-8.965; 6 -6.175,-8.965; 7 -5.525,-8.965; 8 -4.875,-8.965; 9 -4.225,-8.965; 10 -3.575,-8.965; 11 -2.925,-8.965; 12 -2.275,-8.965; 13 -1.625,-8.965; 14 -0.975,-8.965; 15 -0.325,-8.965; 16 0.325,-8.965; 17 0.975,-8.965; 18 1.625,-8.965; 19 2.275,-8.965; 20 2.925,-8.965; 21 3.575,-8.965; 22 4.225,-8.965; 23 4.875,-8.965; 24 5.525,-8.965; 25 6.175,-8.965; 26 6.825,-8.965; 27 7.475,-8.965; 28 8.125,-8.965; 29 8.775,-8.965; 30 9.425,-8.965; 51 9.425,8.965; 52 8.775,8.965; 53 8.125,8.965; 54 7.475,8.965; 55 6.825,8.965; 56 6.175,8.965; 57 5.525,8.965; 58 4.875,8.965; 59 4.225,8.965; 60 3.575,8.965; 61 2.925,8.965; 62 2.275,8.965; 63 1.625,8.965; 64 0.975,8.965; 65 0.325,8.965; 66 -0.325,8.965; 67 -0.975,8.965; 68 -1.625,8.965; 69 -2.275,8.965; 70 -2.925,8.965; 71 -3.575,8.965; 72 -4.225,8.965; 73 -4.875,8.965; 74 -5.525,8.965; 75 -6.175,8.965; 76 -6.825,8.965; 77 -7.475,8.965; 78 -8.125,8.965; 79 -8.775,8.965; 80 -9.425,8.965 | smd 2.2 x 0.35: 31 11.965,-6.175; 32 11.965,-5.525; 33 11.965,-4.875; 34 11.965,-4.225; 35 11.965,-3.575; 36 11.965,-2.925; 37 11.965,-2.275; 38 11.965,-1.625; 39 11.965,-0.975; 40 11.965,-0.325; 41 11.965,0.325; 42 11.965,0.975; 43 11.965,1.625; 44 11.965,2.275; 45 11.965,2.925; 46 11.965,3.575; 47 11.965,4.225; 48 11.965,4.875; 49 11.965,5.525; 50 11.965,6.175; 81 -11.965,6.175; 82 -11.965,5.525; 83 -11.965,4.875; 84 -11.965,4.225; 85 -11.965,3.575; 86 -11.965,2.925; 87 -11.965,2.275; 88 -11.965,1.625; 89 -11.965,0.975; 90 -11.965,0.325; 91 -11.965,-0.325; 92 -11.965,-0.975; 93 -11.965,-1.625; 94 -11.965,-2.275; 95 -11.965,-2.925; 96 -11.965,-3.575; 97 -11.965,-4.225; 98 -11.965,-4.875; 99 -11.965,-5.525; 100 -11.965,-6.175
DIL16/12 = drill 0.813 long: 1 -8.89,-3.81; 2 -6.35,-3.81; 3 -3.81,-3.81; 4 3.81,-3.81; 5 6.35,-3.81; 6 8.89,-3.81; 7 8.89,3.81; 8 6.35,3.81; 9 3.81,3.81; 10 -3.81,3.81; 11 -6.35,3.81; 12 -8.89,3.81
AK500/2-H = drill 1.321 long: 1 -2.515,0; 2 2.515,0

### Placement (x,y rotation side)
ACT_LED  64.38,3.01 0 top
C1  73.02,20.79 0 bottom
C2  73.02,15.71 180 bottom
C3  73.02,28.41 180 bottom
C4  73.02,25.87 180 bottom
C5  34.92,46.19 180 top
C6  28.57,42.38 90 top
C7  29.84,37.3 180 top
C8  23.24,55.08 180 bottom
C9  38.98,55.08 0 bottom
C10  59.05,62.7 270 top
C11  67.43,55.08 180 top
C12  62.86,62.7 270 bottom
C13  68.7,51.27 270 bottom
C14  73.02,13.17 180 bottom
C15  53.06,41.36 90 bottom
C16  51.28,48.17 270 bottom
C17  65.6,26.56 0 bottom
C18  54.71,26.58 180 bottom
C24  54.73,50.51 0 bottom
C25  56.71,37.05 180 bottom
C26  57.07,40.6 270 bottom
C27  57.02,44.92 90 bottom
C28  4.44,48.98 90 top
C29  4.44,33.24 270 top
C30  52.7,61.18 90 top
C31  52.7,66.26 270 top
C32  50.16,61.18 270 top
C33  50.16,66.26 270 top
C34  37.21,61.18 90 top
C35  4.44,68.54 270 top
C36  4.44,52.79 270 top
C37  13.08,63.21 90 bottom
C38  34.67,61.18 90 top
C39  34.67,66.26 90 top
C40  32.13,61.18 270 top
C41  32.13,66.26 270 top
C42  25.78,60.67 90 top
CAN  27.3,4.28 0 top
COM  36.19,74.13 0 top
D2  66.67,73.62 0 top
ETH  52.7,10.63 0 top
F1  14.6,24.6 90 top
H1  75.56,4.28 0 top
H2  4.44,81.75 0 top
H3  4.44,4.28 0 top
H4  75.56,81.75 0 bottom
IC1  43.81,63.72 90 top
IC2  32.38,42.38 180 bottom
IC3  73.53,51.27 90 top
IC4  15.87,44.92 270 top
IC5  27.3,18.25 180 bottom
IC8  13.33,63.21 0 top
IC9  25.78,63.72 90 top
ISP  38.73,8.09 270 top
ISP_48  14.35,78.45 90 top
JTAG  32.38,27.9 0 top
KK1  71.24,51.27 90 top
LED3  12.06,3.01 0 top
LED199  17.14,3.01 0 top
LINK_LED  69.21,3.01 0 top
POWER_LED1  54.99,83.27 0 top
Q1  31.11,55.08 180 top
Q2  60.32,26.63 0 top
Q3  4.44,41.11 270 top
Q4  4.44,60.67 90 top
R1  73.02,32.22 180 bottom
R2  29.84,46.19 0 top
R3  22.22,31.97 270 bottom
R4  37.46,19.52 90 bottom
R5  40,19.52 90 bottom
R6  34.92,19.52 90 bottom
R7  54.99,79.21 0 bottom
R8  17.39,55.08 90 top
R9  11.81,55.08 90 top
R10  47.62,25.87 90 top
R11  50.16,25.87 270 top
R12  45.08,25.87 270 top
R13  52.19,37.05 0 bottom
R14  14.6,55.08 90 top
R15  13.33,8.09 90 bottom
R16  69.21,8.09 90 bottom
R17  64.13,8.09 90 bottom
R18  15.87,8.09 90 bottom
R20  27.3,18.25 0 bottom
U$1  53.97,43.65 270 top
U$2  73.02,20.79 90 top
X2  64.13,81.75 180 top

### Tracks (layer width: path | path; a pad name or v marks a point on that pad's centre or on a via)
A0  (via drill 0.61)
  Top 0.254: v43.05,50.76 43.56,50.76 43.56,50.51 44.06,50.51 U$1.5
  Bottom 0.254: v43.05,50.76 43.05,48.73 41.27,46.95 40.76,46.95 IC2.35
A1  (via drill 0.61)
  Top 0.254: v41.78,45.94 43.05,47.21 43.05,48.73 43.56,49.24 44.06,49.24 U$1.7
  Bottom 0.254: v41.78,45.94 40.76,45.94 IC2.36
A2  (via drill 0.61)
  Top 0.254: v43.05,45.68 43.56,46.19 43.56,48.48 44.06,48.48 U$1.8
  Bottom 0.254: v43.05,45.68 42.29,44.92 41.52,44.92 41.27,45.17 40.76,45.17 IC2.37
A3  (via drill 0.61)
  Top 0.254: v46.86,47.97 46.1,47.97 U$1.9
  Bottom 0.254: v46.86,47.97 43.3,44.41 40.76,44.41 IC2.38
A4  (via drill 0.61)
  Top 0.254: v46.86,46.7 46.35,47.21 46.1,47.21 U$1.10
  Bottom 0.254: v46.86,46.7 43.81,43.65 40.76,43.65 IC2.39
A5  (via drill 0.61)
  Top 0.254: v42.54,42.63 43.05,42.13 43.05,35.52 43.56,35.01 44.06,35.01 U$1.29
  Bottom 0.254: v42.54,42.63 42.29,42.89 40.76,42.89 IC2.40
A6  (via drill 0.61)
  Top 0.254: v41.52,41.87 42.54,40.86 42.54,35.27 43.56,34.25 44.06,34.25 U$1.30
  Bottom 0.254: v41.52,41.87 40.76,41.87 IC2.41
A7  (via drill 0.61)
  Top 0.254: v38.73,41.11 39.24,40.6 v39.24,29.43 | v49.4,29.43 49.14,29.68 49.14,30.7 U$1.33
  Bottom 0.254: v38.73,41.11 39.75,41.11 IC2.42 | v39.24,29.43 v49.4,29.43
A8  (via drill 0.61)
  Top 0.254: v38.48,47.97 37.71,47.21 37.71,44.16 v38.22,43.65 | v27.3,41.62 23.74,38.06 23.74,27.14 v23.24,26.63 | v43.56,24.85 44.57,24.85 R12.2
  Bottom 0.254: v38.48,47.97 38.48,49.75 IC2.32 | v38.22,43.65 36.19,41.62 v27.3,41.62 | v23.24,26.63 25.01,24.85 v43.56,24.85
A9  (via drill 0.61)
  Top 0.254: v34.67,44.92 34.16,44.41 v34.16,39.33 | v27.55,37.55 24.76,34.76 24.76,25.62 27.05,23.33 27.05,20.79 25.01,18.76 24.51,18.76 24.51,18.5 24,18 24,17.49 25.27,16.22 27.55,16.22 27.55,7.58 33.4,1.74 42.54,1.74 42.54,20.28 46.35,24.09 46.35,25.87 47.11,26.63 R10.2
  Bottom 0.254: v34.67,44.92 37.46,44.92 37.46,49.75 IC2.31 | v34.16,39.33 32.38,37.55 v27.55,37.55
A10  (via drill 0.61)
  Top 0.254: v27.05,46.7 27.81,47.46 27.81,48.98 29.33,50.51 34.16,50.51 v34.16,51.78 | v46.86,51.52 46.35,51.02 46.1,51.02 U$1.4
  Bottom 0.254: v27.05,46.7 27.05,43.4 26.28,42.63 25.01,42.63 IC2.9 | v34.16,51.78 34.16,52.29 42.03,52.29 42.79,53.05 45.33,53.05 v46.86,51.52
CAN_INT  (via drill 0.61)
  Top 0.254: v22.73,42.13 21.71,42.13 IC4.12
  Bottom 0.254: v22.73,42.13 24,42.13 IC2.8
CS  (via drill 0.61)
  Top 0.254: v26.03,43.65 23.74,45.94 23.74,46.19 22.73,47.21 21.71,47.21 IC4.16
  Bottom 0.254: v26.03,43.65 25.01,43.65 IC2.10
D0  (via drill 0.61)
  Top 0.254: v45.33,32.47 47.11,34.25 47.11,36.79 47.87,37.55 48.89,37.55 49.4,37.05 53.97,37.05 v53.97,35.52 | v51.43,33.74 51.18,33.49 51.18,32.73 U$1.36
  Bottom 0.254: v45.33,32.47 36.95,32.47 36.95,34 IC2.51 | v53.97,35.52 52.19,33.74 v51.43,33.74
D1  (via drill 0.61)
  Top 0.254: v42.79,33.49 v47.87,28.41 | v50.16,28.41 51.68,29.93 51.68,30.7 U$1.37
  Bottom 0.254: v42.79,33.49 37.71,33.49 37.71,34 IC2.50 | v47.87,28.41 v50.16,28.41
D2  (via drill 0.61)
  Top 0.254: v48.13,35.01 49.91,35.01 49.91,35.27 50.67,36.03 52.45,36.03 52.45,32.73 U$1.38
  Bottom 0.254: v48.13,35.01 38.48,35.01 IC2.49
D3  (via drill 0.61)
  Top 0.254: v48.13,36.54 52.95,36.54 52.95,32.73 U$1.39
  Bottom 0.254: v48.13,36.54 40.76,36.54 IC2.48
D4  (via drill 0.61)
  Top 0.254: v27.55,40.35 24.25,37.05 v24.25,24.35 | v60.57,23.08 61.08,23.08 v61.08,30.19 | v53.46,29.68 53.72,29.93 53.72,30.7 U$1.40
  Bottom 0.254: v27.55,40.35 34.41,40.35 37.46,37.3 39.75,37.3 IC2.47 | v24.25,24.35 42.79,24.35 44.06,23.08 v60.57,23.08 | v61.08,30.19 53.97,30.19 v53.46,29.68
D5  (via drill 0.61)
  Top 0.254: v41.52,37.81 41.78,37.55 41.78,33.24 v46.6,28.41 | v51.68,27.39 53.72,27.39 53.72,28.66 54.48,29.43 54.48,30.19 54.22,30.44 54.22,30.7 U$1.41
  Bottom 0.254: v41.52,37.81 40.76,37.81 IC2.46 | v46.6,28.41 47.62,27.39 v51.68,27.39
D6  (via drill 0.61)
  Top 0.254: v48.13,40.35 56.26,40.35 v56.26,35.27 | v54.22,33.74 54.99,32.98 54.99,32.73 U$1.42
  Bottom 0.254: v48.13,40.35 46.6,38.82 40.76,38.82 IC2.45 | v56.26,35.27 54.73,33.74 v54.22,33.74
D7  (via drill 0.61)
  Top 0.254: v46.86,40.35 49.65,37.55 55.24,37.55 55.24,33.49 55.49,33.24 55.49,32.73 U$1.43
  Bottom 0.254: v46.86,40.35 46.1,39.59 40.76,39.59 IC2.44
GND  (via drill 0.61)
  Top 0.254: ISP.10 ISP.8 ISP.6 ISP.4 41.27,11.9 41.27,25.87 37.97,29.17 JTAG.10 36.95,29.68 36.95,32.22 35.43,33.74 v35.43,36.03 35.43,44.41 35.68,44.67 35.68,45.94 C5.1 | 62.86,35.52 62.86,35.01 U$1.52 63.88,34.76 64.38,34.76 64.38,24.09 59.3,19.01 | 62.86,36.79 62.86,36.28 U$1.54 62.86,36.03 62.86,35.52 | 62.86,36.79 62.86,37.55 U$1.56 | 62.86,36.79 U$1.55 | 62.86,35.52 U$1.53 | 59.3,19.01 61.08,17.23 ETH.G2 | 59.3,19.01 56.26,22.06 56.26,30.7 U$1.44 | CAN.1 22.47,11.65 22.47,12.41 23.24,13.17 IC5.8 23.49,18.5 25.78,20.79 IC5.2 | 9.52,21.04 9.52,10.88 5.71,7.07 H3.B3,0 | 9.52,21.04 9.52,39.08 10.03,39.59 IC4.9 | 8,64.22 8,62.95 8.5,62.95 IC8.5 | 8,64.22 8.5,64.22 IC8.3 | 5.46,66.76 8,64.22 | 5.46,66.76 5.46,68.54 4.69,69.3 C35.1 H2.B3,0 7.23,83.02 12.57,83.02 ISP_48.10 ISP_48.8 ISP_48.6 ISP_48.4 | 5.46,66.76 5.46,52.29 4.69,52.29 C36.2 C28.2 4.19,49.75 3.42,48.98 3.42,32.73 4.19,32.73 C29.2 4.69,31.97 4.69,21.04 9.52,21.04 | C6.1 28.82,41.11 30.35,39.59 30.35,37.55 C7.1 30.35,37.05 v30.35,36.03 30.35,33.74 28.06,31.46 28.06,29.93 JTAG.2 | 25.78,65.49 23.49,65.49 IC9.11 | 25.78,65.49 C42.2 25.52,61.18 24,61.18 24,60.92 23.49,60.41 IC9.15 21.71,60.67 20.44,60.67 19.43,61.68 19.43,63.46 18.16,63.46 IC8.21 17.14,63.46 v16.12,63.46 | 25.78,68.03 28.06,68.03 IC9.8 | 25.78,68.03 25.78,65.49 | COM.6 31.36,75.15 26.03,75.15 COM.G1 24.76,71.84 24.76,69.05 25.78,68.03 | 35.68,62.19 36.95,62.19 C34.2 37.46,62.19 38.22,62.19 39.75,60.67 IC1.15 | 35.68,62.19 34.92,62.19 C38.2 | 35.68,68.29 34.92,67.53 C39.2 | 35.68,68.29 35.68,72.35 COM.3 | 35.68,68.29 35.68,62.19 | 45.08,38.06 45.08,37.55
  Top 0.254: U$1.28 45.08,35.52 45.08,36.03 U$1.27 45.08,36.28 45.08,36.79 | 45.08,37.55 45.08,36.79 | 45.08,37.55 U$1.25 | 45.08,36.79 U$1.26 | U$1.13 45.08,45.17 45.08,44.67 U$1.14 44.06,44.67 43.56,44.67 43.56,41.87 44.06,41.36 U$1.19 45.08,41.36 | 45.08,45.94 45.08,46.44 U$1.11 | 45.08,45.94 45.08,45.43 U$1.13 | 45.08,45.94 U$1.12 | 45.08,41.36 45.08,41.87 U$1.18 | 45.08,38.82 45.08,39.33 U$1.22 45.08,39.59 45.08,40.09 | 45.08,40.09 45.08,40.6 U$1.20 45.08,40.86 45.08,41.36 | 45.08,40.09 U$1.21 | 45.08,38.82 45.08,38.06 | 45.08,38.06 U$1.24 | 45.08,38.82 U$1.23 | v46.86,45.43 46.1,45.43 U$1.13 | 53.72,55.59 54.22,55.59 U$1.90 | 51.68,55.59 51.18,55.59 U$1.95 | 52.95,55.59 52.45,55.59 U$1.93 52.19,55.59 51.68,55.59 | 51.68,55.59 U$1.94 | 53.72,55.59 52.95,55.59 | 53.72,55.59 U$1.91 53.72,56.6 53.72,61.68 | 52.95,55.59 U$1.92 | 56.26,55.59 55.75,55.59 U$1.88 | 56.26,55.59 56.76,55.59 U$1.86 57.02,56.6 57.02,61.68 | 56.26,55.59 U$1.87 | C31.2 C30.2 52.95,61.68 53.72,61.68 | U$1.64 61.84,42.63 58.8,42.63 58.8,54.57 U$1.83 58.8,56.6 58.8,60.16 C10.- 58.8,61.68 57.02,61.68 | 57.02,61.68 53.72,61.68
  Bottom 0.254: C2.1 72.51,15.46 72.51,14.19 73.02,14.19 73.78,13.42 C14.2 74.29,12.92 74.29,7.07 H1.B3,0 72.77,5.55 62.1,5.55 ETH.G2 ETH.G1 40.51,6.06 ISP.8 | CAN.1 21.2,10.12 11.81,10.12 7.23,5.55 H3.B3,0 | 29.08,35.27 29.33,35.01 IC2.60 | 29.08,35.27 28.82,35.52 27.3,35.52 27.3,35.01 IC2.63 | 29.08,35.27 28.82,35.01 IC2.61 | IC2.59 30.35,34.76 29.84,34.76 IC2.60 | 35.17,36.03 35.17,37.05 31.62,37.05 30.6,36.03 | 35.17,36.03 35.17,35.01 IC2.53 | 30.6,36.03 29.59,35.01 IC2.60 | v35.43,36.03 35.17,36.03 | 30.6,36.03 v30.35,36.03 | 58.54,42.38 57.27,43.65 C27.1 | 58.54,42.38 58.54,40.09 57.53,40.09 C26.2 56.76,40.09 53.46,40.09 C15.1 53.21,40.09 53.21,37.55 R13.1 C25.1 56.26,36.79 56.26,36.28 56.51,36.28 65.4,27.39 67.18,27.39 | C4.2 73.53,26.12 73.53,27.39 73.02,27.39 72.26,28.16 C3.1 71.75,28.16 67.94,28.16 67.18,27.39 | 67.18,27.39 66.67,26.89 C17.1 66.16,26.12 65.65,25.62 54.73,25.62 54.22,26.12 C18.1 53.46,26.38 47.37,26.38 45.84,27.9 38.73,27.9 JTAG.10 | IC2.22 30.35,50.76 30.35,51.52 29.33,52.54 22.73,52.54 22.73,54.83 C8.1 21.97,55.33 21.46,55.84 17.65,55.84 17.65,61.43 15.87,63.21 | 15.87,63.21 15.62,63.46 13.58,63.46 13.33,63.72 C37.2 | v16.12,63.46 15.87,63.21 | 37.46,74.13 38.98,74.13 39.75,74.89 COM.9 41.02,75.15 46.35,75.15 COM.G2 54.73,74.13 | 37.46,74.13 COM.3 | 50.41,47.97 50.67,47.97 50.92,47.71 C16.2 | 50.41,50.25 50.41,47.97 | 50.41,50.25 53.46,50.25 C24.2 54.22,50.76 54.22,51.52 66.16,51.52 | 50.41,50.25 47.11,53.56 41.52,53.56 40.25,54.83 C9.1 | v46.86,45.43 49.4,47.97 50.41,47.97 | 37.46,74.13 33.4,74.13 32.63,74.89 COM.6 | 58.54,42.38 63.37,47.21 68.7,47.21 72,50.51 71.97,50.8
  Bottom 0.254: H4.B3,0 72.77,83.02 71.5,84.29 63.37,84.29 62.35,83.27 X2.2 | 57.81,77.68 57.53,77.94 | R7.1 56.26,78.7 57.27,77.69 57.56,77.41 | ISP_48.4 14.35,74.64 21.2,74.64 COM.G1
  Bottom 0.813: 62.86,61.43 62.35,60.92 C10.- 54.73,60.92 54.73,74.13 54.73,74.38 57.56,77.41 57.81,77.68 X2.2 | 62.86,61.43 C12.2 | 62.86,61.43 66.16,55.08 | 66.16,55.08 C11.- | 66.16,55.08 66.16,51.52 66.16,50.42 C13.2 71.97,50.8 IC3.GND
  pour Bottom: 54.2,26.73 arc-90 56.99,29.53 63.32,29.53 arc-90 66.14,25.95 arc-90 63.16,23.74 57.09,23.74 arc-90 54.2,26.63
  pour Top: 54.2,26.73 arc-90 56.99,29.53 63.32,29.53 arc-90 66.14,25.95 arc-90 63.16,23.74 57.09,23.74 arc-90 54.2,26.63
  pour Top: 4.34,35.24 arc-90 1.54,38.04 1.54,44.36 arc-90 4.36,46.93 arc-90 7.34,44.21 7.34,38.14 arc-90 4.44,35.24
  pour Bottom: 4.34,35.24 arc-90 1.54,38.04 1.54,44.36 arc-90 4.36,46.93 arc-90 7.34,44.21 7.34,38.14 arc-90 4.44,35.24
  pour Top: 4.34,54.8 arc-90 1.54,57.59 1.54,63.92 arc-90 4.36,66.48 arc-90 7.34,63.77 7.34,57.7 arc-90 4.44,54.8
  pour Top: 36.98,55.18 arc90 34.18,57.98 27.86,57.98 arc90 25.29,55.16 arc90 28.01,52.18 34.08,52.18 arc90 36.98,55.08
  pour Bottom: 4.34,54.8 arc-90 1.54,57.59 1.54,63.92 arc-90 4.36,66.48 arc-90 7.34,63.77 7.34,57.7 arc-90 4.44,54.8
  pour Bottom: 36.98,54.98 arc-90 34.18,52.18 27.86,52.18 arc-90 25.29,55 arc-90 28.01,57.98 34.08,57.98 arc-90 36.98,55.08
MISO  (via drill 0.61)
  Top 0.254: v22.73,45.94 21.71,45.94 IC4.15 19.93,46.19 18.16,44.41 18.16,22.82 v20.7,20.28
  Bottom 0.254: v22.73,45.94 24,45.94 IC2.13 | v20.7,20.28 34.41,20.28 R6.2
MISO_48
  Top 0.254: IC8.16 16.12,58.38 16.12,57.37 15.11,56.35 R14.2
MOSI  (via drill 0.61)
  Top 0.254: IC4.14 21.71,44.67 v22.73,44.67 23.74,43.65 23.74,41.87 23.24,41.36 23.24,28.41 v22.73,27.9 | v39.75,22.82 38.98,23.58 v38.98,26.89
  Bottom 0.254: v22.73,44.67 23.24,45.17 24,45.17 IC2.12 | v39.75,22.82 39.75,20.79 R5.2 | v38.98,26.89 37.97,27.9 v22.73,27.9
MOSI_48
  Top 0.254: IC8.15 15.36,58.38 15.36,58.13 14.35,57.11 12.31,57.11 12.31,56.35 R9.2
N$1  (via drill 0.61)
  Top 0.254: v64.89,38.82 63.88,38.82 U$1.58
  Bottom 0.254: U$2.6 75.81,30.19 74.29,31.71 R1.2 73.78,32.73 73.02,33.49 70.23,33.49 v64.89,38.82
N$2  (via drill 0.61)
  Top 0.254: v12.82,47.46 12.82,49.75 11.81,49.75 IC4.1
  Bottom 0.254: v12.82,47.46 12.82,37.55 12.57,37.55 11.55,36.54 11.55,26.89 19.93,26.89 23.49,23.33 IC5.1
N$3  (via drill 0.61)
  Top 0.254: v73.27,29.68 75.05,27.9 75.05,25.87 75.81,25.11 U$2.4 | v61.08,39.08 61.08,39.33 61.84,39.33 U$1.59
  Bottom 0.254: v73.27,29.68 72.77,29.68 72.77,31.71 R1.1 71.75,32.73 67.43,32.73 v61.08,39.08
N$4  (via drill 0.61)
  Top 0.254: v57.53,38.32 57.53,32.73 U$1.46
  Bottom 0.254: U$2.3 77.34,17.49 74.29,20.54 C1.1 74.29,21.04 78.61,21.04 78.61,36.03 71.5,43.14 63.88,43.14 60.07,39.33 58.54,39.33 v57.53,38.32
N$5  (via drill 0.61)
  Top 0.254: v28.57,33.24 28.57,37.05 C7.2
  Bottom 0.254: v28.57,33.24 27.81,34 IC2.62
N$6
  Bottom 0.254: C9.2 37.71,54.83 34.16,54.83 Q1.1 31.87,55.08 31.87,50.76 IC2.24
N$7
  Bottom 0.254: C8.2 24.51,54.83 28.06,54.83 Q1.2 31.11,55.08 31.11,50.76 IC2.23
N$8
  Bottom 0.813: D2.C C10.+ 62.35,64.48 62.86,63.97 | IC3.IN 78.35,48.73 78.35,56.6 62.86,63.97 | 62.86,63.97 C12.1
N$9  (via drill 0.61)
  Top 0.254: v44.83,67.53 44.83,67.02 46.1,67.02 IC1.7
  Bottom 0.254: v44.83,67.53 41.27,71.08 32.38,71.08 31.11,72.35 COM.1
N$10
  Bottom 0.813: X2.1 66.67,81.75 D2.A
N$11  (via drill 0.61)
  Top 0.254: v60.07,21.04 57.78,23.33 57.78,24.35 56.76,25.36 56.76,30.7 U$1.45
  Bottom 0.254: U$2.1 77.85,12.41 78.61,12.41 78.61,14.95 78.1,15.46 76.07,15.46 74.8,16.73 72.51,16.73 72.51,20.54 C1.2 71.75,21.04 v60.07,21.04
N$12
  Bottom 0.254: C3.2 74.29,28.16 75.05,27.39 75.56,27.39 U$2.5
N$13
  Bottom 0.254: C2.2 74.29,15.46 75.05,14.69 75.56,14.69 U$2.2
N$14
  Bottom 0.254: C14.1 71.75,13.42 70.99,14.19 70.48,14.19 U$2.11
N$15
  Bottom 0.254: C4.1 71.75,26.12 70.99,26.89 70.48,26.89 U$2.8
N$16
  Bottom 0.813: F1.1 14.6,12.41 32.38,12.41 32.38,9.53 CAN.4
N$17  (via drill 0.61)
  Top 0.254: v13.33,53.05 14.09,53.81 R14.1
  Bottom 0.254: v13.33,53.05 9.77,56.6 3.68,56.6 2.15,58.13 2.15,60.67 1.39,60.67 1.39,78.45 8.76,78.45 12.57,82.26 14.35,82.26 ISP_48.9
N$18
  Bottom 0.254: U$2.12 67.94,12.15 64.89,15.2 49.91,15.2 48.64,16.47 ETH.1-1
N$19
  Bottom 0.254: U$2.10 67.94,16.73 66.92,15.71 50.41,15.71 49.65,16.47 49.65,19.01 ETH.1-2
N$20
  Bottom 0.254: U$2.9 67.94,24.35 65.65,22.06 52.95,22.06 50.67,19.77 50.67,17.49 ETH.1-3
N$21  (via drill 0.61)
  Top 0.254: v8,22.57 8,48.48 10.03,48.48 IC4.2 | v25.01,17.74 29.08,17.74 29.08,16.98 29.84,16.22 31.11,16.22 IC5.4
  Bottom 0.254: v8,22.57 12.82,17.74 v25.01,17.74
N$22  (via drill 0.61)
  Top 0.254: v32.13,17.74 32.63,17.23 32.63,12.92 35.17,10.38 35.17,5.3 ISP.9
  Bottom 0.254: v32.13,17.74 33.9,17.74 34.41,18.25 R6.1
N$23
  Top 0.254: IC5.6 28.82,13.17 28.82,11.65 CAN.3
  Bottom 0.254: R20.1 28.32,17.74 28.32,15.71 IC5.6
N$24  (via drill 0.61)
  Top 0.254: v67.43,19.01 67.43,28.41 68.19,29.17 U$2.7
  Bottom 0.254: v67.43,19.01 66.67,18.25 56.26,18.25 55.24,19.27 ETH.1-6
N$25
  Bottom 0.254: R5.1 39.49,18.25 39.49,14.44 38.73,14.44 ISP.1
N$26
  Bottom 0.254: IC2.1 24,36.28 24,33.24 22.73,33.24 R3.1
N$27  (via drill 0.61)
  Top 0.254: v19.68,25.87 19.17,26.38 19.17,40.86 19.93,40.86 IC4.11 | v12.82,19.01 11.55,17.74 11.55,5.04 13.08,3.52 LED3.K
  Bottom 0.254: v12.82,19.01 v19.68,25.87
N$28  (via drill 0.61)
  Top 0.254: v67.69,6.57 67.69,3.52 LINK_LED.A
  Bottom 0.254: v67.69,6.57 68.45,6.57 68.7,6.82 R16.1
N$29  (via drill 0.61)
  Top 0.254: v36.19,17.49 35.68,16.98 35.68,7.33 ISP.7
  Bottom 0.254: v36.19,17.49 36.95,18.25 R4.1
N$30  (via drill 0.61)
  Top 0.254: v9.52,58.64 9.52,54.83 11.3,54.83 R9.1
  Bottom 0.254: v9.52,58.64 8,60.16 3.42,60.16 2.15,61.43 2.15,72.1 14.35,72.1 ISP_48.1
N$31
  Bottom 0.254: R7.2 54.73,79.72 54.73,83.02 55.75,83.02 POWER_LED1.K
N$32  (via drill 0.61)
  Top 0.254: v31.87,36.03 32.13,36.28 v32.13,42.63 | v36.95,43.65 37.21,43.9 37.21,50.76 38.73,52.29 38.73,56.86 v35.94,59.65 | v53.46,71.84 53.46,82.77 POWER_LED1.A
  Bottom 0.254: v31.87,36.03 31.36,36.03 31.36,35.01 IC2.58 | v32.13,42.63 33.14,43.65 v36.95,43.65 | v35.94,59.65 38.98,62.7 44.32,62.7 v53.46,71.84
N$33
  Top 0.254: IC1.13 39.75,63.21 37.46,63.21 37.46,73.37 36.7,74.13 33.9,74.13 33.9,73.37 COM.2
N$34
  Top 0.254: U$1.51 62.61,34.25 62.61,27.14 Q2.2
  Bottom 0.406: C17.2 64.71,26.56 arc-90 64.64,26.63 Q2.2
N$35
  Top 0.254: U$1.50 60.07,30.7 60.07,30.19 58.29,30.19 58.29,27.14 Q2.1
  Bottom 0.406: Q2.1 58.03,26.63 arc-90 57.98,26.58 C18.2
N$36  (via drill 0.61)
  Top 0.254: R10.1 48.13,25.11 49.65,25.11 R11.2 50.67,24.6 50.67,19.27 51.94,18 51.94,1.99 70.99,1.99 71.5,2.5 71.5,29.17 v75.31,32.98 | v64.89,42.13 64.89,51.02 63.88,51.02 U$1.77
  Bottom 0.254: v64.89,42.13 68.96,38.06 68.96,35.52 72.77,35.52 v75.31,32.98
N$37  (via drill 0.61)
  Top 0.254: v35.17,58.38 35.17,50.76 33.4,48.98 33.4,47.71 35.94,47.71 36.7,46.95 36.7,44.92 35.94,44.16 35.94,42.63 38.48,42.63 39.75,41.36 39.75,31.97 44.57,27.14 R12.1 | v61.08,53.05 61.84,52.29 U$1.79
  Bottom 0.254: v35.17,58.38 35.43,58.64 55.49,58.64 v61.08,53.05
N$38  (via drill 0.61)
  Top 0.254: v20.19,35.52 20.19,39.59 IC4.10 | v17.14,32.47 16.63,31.97 16.63,15.2 18.16,13.68 18.16,3.52 LED199.K
  Bottom 0.254: v17.14,32.47 v20.19,35.52
N$39  (via drill 0.61)
  Top 0.254: v50.92,35.01 49.65,33.74 49.65,32.73 U$1.34
  Bottom 0.254: v50.92,35.01 50.92,36.54 R13.2
N$40  (via drill 0.61)
  Top 0.254: v19.17,59.91 19.17,54.83 17.9,54.83 R8.1 | v19.17,64.73 19.17,77.43 ISP_48.7
  Bottom 0.254: v19.17,59.91 v19.17,64.73
N$44  (via drill 0.61)
  Top 0.254: v62.61,7.33 62.86,7.07 62.86,3.52 ACT_LED.A
  Bottom 0.254: v62.61,7.33 63.62,7.33 R17.1
N$45  (via drill 0.61)
  Top 0.254: v60.07,38.32 60.07,40.6 61.84,40.6 U$1.61 | v69.97,31.2 70.99,30.19 70.99,3.26 LINK_LED.K
  Bottom 0.254: v60.07,38.32 67.18,31.2 v69.97,31.2
N$47  (via drill 0.61)
  Top 0.254: v64.89,40.09 64.89,40.86 64.38,41.36 63.88,41.36 U$1.62 | v64.89,37.55 65.4,37.55 65.4,29.93 66.92,28.41 66.92,19.77 65.91,18.76 65.91,3.52 ACT_LED.K
  Bottom 0.254: v64.89,40.09 63.88,39.08 63.88,37.55 v64.89,37.55
N$48
  Bottom 0.254: R15.1 12.82,6.82 12.82,4.03 12.06,4.03 11.3,3.26 LED3.A
N$52
  Bottom 0.254: LED199.A R18.1
N$53  (via drill 0.61)
  Top 0.254: C28.1 4.69,47.71 4.69,44.16 Q3.1 | v9.01,42.63 10.03,42.63 IC4.7
  Bottom 0.254: v9.01,42.63 8.5,43.14 4.95,43.14 Q3.1
N$54
  Top 0.254: Q3.2 4.19,38.06 4.19,34.51 C29.1 4.69,34 5.46,33.24 5.46,21.55 8.25,21.55 9.01,22.31 9.01,40.86 10.03,40.86 IC4.8
N$59
  Top 0.254: IC5.7 25.78,13.17 25.78,11.65 CAN.2
  Bottom 0.254: R20.2 26.28,17.74 26.28,15.71 IC5.7
N$60
  Top 0.254: C32.2 49.91,59.91 48.13,59.91 48.13,59.65 47.87,59.4 IC1.1
N$61
  Top 0.254: C33.2 49.91,64.99 47.87,62.95 IC1.4
N$68  (via drill 0.61)
  Top 0.254: v34.67,33.24 36.19,31.71 36.19,27.9 JTAG.9
  Bottom 0.254: v34.67,33.24 34.41,33.24 34.41,34 IC2.54
N$69  (via drill 0.61)
  Top 0.254: v33.65,32.47 33.65,22.06 34.16,21.55 v34.16,15.46 | v30.09,17.23 30.09,26.12 JTAG.3
  Bottom 0.254: v33.65,32.47 33.65,34 IC2.55 | v34.16,15.46 33.65,15.96 31.87,15.96 30.6,17.23 v30.09,17.23
N$70  (via drill 0.61)
  Top 0.254: v27.55,32.47 25.78,30.7 v25.78,26.38
  Bottom 0.254: v27.55,32.47 28.06,31.97 32.63,31.97 32.63,34 IC2.56 | v25.78,26.38 26.79,25.36 31.11,25.36 JTAG.5
N$71  (via drill 0.61)
  Top 0.254: v31.62,32.98 28.57,29.93 28.57,27.9 JTAG.1
  Bottom 0.254: v31.62,32.98 31.87,32.98 31.87,34 IC2.57
N$72
  Top 0.254: C33.1 49.91,66.76 48.89,66.76 48.89,65.49 47.87,64.48 IC1.5
N$73
  Top 0.254: C32.1 49.91,61.94 47.87,61.94 IC1.3
N$74  (via drill 0.61)
  Top 0.254: v42.79,76.16 42.79,61.94 41.52,61.94 IC1.14
  Bottom 0.254: v42.79,76.16 42.29,76.67 36.44,76.67 35.43,75.65 COM.7
N$75
  Top 0.254: IC1.8 46.1,68.29 44.32,70.07 44.32,76.67 42.79,78.19 37.97,78.19 37.97,75.91 COM.8
N$76
  Top 0.254: C30.1 52.45,59.91 50.92,58.38 45.33,58.38 45.33,59.91 46.1,60.67 IC1.2
N$77
  Top 0.254: C31.1 52.45,67.53 51.18,68.8 48.38,68.8 48.38,66.26 47.87,65.75 IC1.6
N$78  (via drill 0.61)
  Top 0.254: v31.87,73.88 31.87,69.05 29.84,67.02 IC9.7
  Bottom 0.254: v31.87,73.88 31.87,72.35 32.13,72.35 32.89,71.59 37.21,71.59 38.22,72.61 COM.4
N$79  (via drill 0.61)
  Top 0.254: C35.2 4.69,67.27 4.69,63.72 Q4.2 | v10.54,60.92 10.54,61.18 9.52,61.18 IC8.7
  Bottom 0.254: v10.54,60.92 8.76,62.7 4.95,62.7 Q4.2
N$80  (via drill 0.61)
  Top 0.254: C36.1 4.19,54.06 4.19,57.62 Q4.1 | v8,58.89 8,59.65 8.5,60.16 IC8.8
  Bottom 0.254: v8,58.89 7.74,58.64 4.95,58.64 Q4.1
N$82  (via drill 0.61)
  Top 0.254: v24.76,63.21 23.49,63.21 IC9.13
  Bottom 0.254: v24.76,63.21 44.06,63.21 45.84,64.99 45.84,72.35 42.03,72.35 COM.5
N$83
  Top 0.254: C40.2 31.87,59.91 30.09,59.91 30.09,59.65 29.84,59.4 IC9.1
N$84
  Top 0.254: C41.2 31.87,64.99 29.84,62.95 IC9.4
N$85
  Top 0.254: C41.1 31.87,66.76 30.35,66.76 30.35,64.99 29.84,64.48 IC9.5
N$86
  Top 0.254: C40.1 31.87,61.94 29.84,61.94 IC9.3
N$87  (via drill 0.61)
  Top 0.254: v12.31,66 12.31,67.02 IC8.30 | v20.44,65.75 21.71,64.48 IC9.12
  Bottom 0.254: v12.31,66 12.57,65.75 v20.44,65.75
N$88
  Top 0.254: IC8.31 11.3,68.03 11.3,69.81 14.35,72.86 14.35,81.5 15.11,82.26 20.7,82.26 20.7,68.03 21.71,67.02 IC9.10
N$89
  Top 0.254: C38.1 34.41,59.91 33.14,58.64 30.09,58.64 30.09,58.38 27.55,58.38 27.3,58.64 27.3,59.91 28.06,60.67 IC9.2
N$90  (via drill 0.61)
  Top 0.254: v33.4,65.75 34.41,65.75 C39.1 | v27.05,65.75 28.06,65.75 IC9.6
  Bottom 0.254: v27.05,65.75 v33.4,65.75
RST  (via drill 0.61)
  Top 0.254: v28.82,48.73 28.82,46.7 R2.1 28.57,45.68 27.55,44.67 27.55,44.41 | ISP.5 36.19,9.36 36.19,16.22 37.21,17.23 37.21,17.74 36.44,18.5 35.17,18.5 35.17,15.2 34.41,14.44 33.14,14.44 33.14,24.09 31.11,26.12 31.11,27.9 JTAG.6 32.63,29.68 32.63,35.52 33.14,36.03 33.14,42.89 32.38,43.65 28.82,43.65 C6.2 28.32,43.65 27.55,44.41 | 23.24,48.48 26.03,48.48 26.03,45.94 27.55,44.41 | 23.24,48.48 21.71,48.48 IC4.17 | 14.6,70.57 16.89,72.86 16.89,77.18 ISP_48.5 | 14.6,70.57 13.08,69.05 13.08,68.03 IC8.29 | 23.24,48.48 v23.24,58.13 | v18.16,67.02 14.6,70.57
  Bottom 0.254: v28.82,48.73 28.82,49.75 IC2.20 | v23.24,58.13 23.24,67.02 v18.16,67.02
RXD  (via drill 0.61)
  Top 0.254: v17.14,43.4 v17.14,48.98 | v38.98,64.48 39.75,64.48 IC1.12
  Bottom 0.254: v17.14,43.4 23.24,37.3 24,37.3 IC2.2 | v17.14,48.98 17.14,54.83 14.6,54.83 8,61.43 3.68,61.43 2.66,62.45 2.66,68.54 34.92,68.54 v38.98,64.48
RXD1  (via drill 0.61)
  Top 0.254: v34.41,48.73 37.71,52.03 v37.71,56.35 | v44.06,57.62 44.83,58.38 44.83,66.26 43.81,67.27 43.81,76.42 43.05,77.18 41.52,77.18 41.52,74.64 40.51,73.62 40.51,68.29 IC1.9
  Bottom 0.254: v34.41,48.73 34.41,49.75 IC2.27 | v37.71,56.35 38.98,57.62 v44.06,57.62
SCK  (via drill 0.61)
  Top 0.254: v22.73,43.4 21.71,43.4 IC4.13 19.93,43.65 18.66,42.38 18.66,23.58 v22.98,19.27
  Bottom 0.254: v22.73,43.4 23.74,44.41 24,44.41 IC2.11 | v22.98,19.27 23.24,19.52 29.08,19.52 32.13,16.47 38.73,16.47 38.73,19.52 38.48,19.77 37.97,19.77 R4.2
SCK_48
  Top 0.254: IC8.17 17.65,60.16 17.65,56.35 R8.2
SCL  (via drill 0.61)
  Top 0.254: v32.89,51.52 24.76,51.52 24.76,57.11 26.79,59.14 v26.79,64.22 | v11.04,66 12.06,64.99 13.58,64.99 13.58,67.02 IC8.28
  Bottom 0.254: v32.89,51.52 32.89,50.76 IC2.25 | v26.79,64.22 22.98,68.03 13.08,68.03 v11.04,66
SDA  (via drill 0.61)
  Top 0.254: v15.36,62.45 14.6,63.21 14.6,67.02 IC8.27
  Bottom 0.254: v15.36,62.45 15.36,57.37 21.97,50.76 24,50.76 27.05,47.71 33.4,47.71 33.4,49.75 IC2.26
TXD  (via drill 0.61)
  Top 0.254: v3.17,54.06 1.39,55.84 1.39,67.78 v3.17,69.56 | v38.48,69.05 39.24,68.29 39.24,67.53 39.75,67.02 IC1.10
  Bottom 0.254: v3.17,54.06 7.74,54.06 23.74,38.06 24,38.06 IC2.3 | v3.17,69.56 3.68,69.05 v38.48,69.05
TXD1  (via drill 0.61)
  Top 0.254: v43.05,52.03 43.05,61.43 43.81,62.19 v43.81,64.22 | v38.98,65.75 39.75,65.75 IC1.11
  Bottom 0.254: v43.05,52.03 42.79,51.78 35.17,51.78 35.17,50.76 IC2.28 | v43.81,64.22 42.29,65.75 v38.98,65.75
VCC  (via drill 0.61, 0.7)
  Top 0.254: JTAG.7 38.73,22.82 38.73,14.44 ISP.2 | C5.2 R2.2 30.09,46.7 v30.09,48.73 | C42.1 25.52,59.4 23.49,59.4 IC9.16 21.71,59.14 21.71,58.64 | 21.71,51.78 21.71,58.64 | 21.71,51.78 21.71,50.25 IC4.18 13.84,50 13.84,47.21 11.81,45.17 IC4.5 | 21.71,51.78 v22.22,51.78 | 21.71,58.64 19.17,61.18 18.16,61.18 IC8.18 17.14,61.18 15.36,61.18 14.6,61.94 10.79,61.94 v10.54,62.19 | U$1.47 58.29,32.73 58.29,35.27 v58.54,35.52 60.07,37.05 | 60.07,37.05 61.08,38.06 61.84,38.06 U$1.57 | 45.08,43.4 45.08,42.63 U$1.17 | 45.08,43.4 45.08,43.9 U$1.15 46.1,43.9 47.87,43.9 47.87,49.75 | 45.08,43.4 U$1.16 | C34.1 37.46,59.91 39.49,59.91 39.49,59.65 39.75,59.4 IC1.16 41.52,59.14 41.52,49.75 44.06,49.75 U$1.6 46.1,49.75 47.87,49.75 | 50.41,49.75 54.99,54.32 54.99,54.57 U$1.89 | 50.41,49.75 47.87,49.75 | 60.07,37.05 56.76,40.35 56.76,43.4 v54.22,45.94 50.41,49.75 | R11.1 49.65,27.14 48.89,27.9 48.89,28.66 48.38,29.17 48.38,30.7 U$1.32 48.38,31.71 47.87,31.71 U$1.31 47.87,31.46 v46.86,31.46 | U$1.65 63.88,43.4 64.38,43.4 64.38,46.44 63.88,46.44 U$1.70 61.84,46.7 60.07,46.7 60.07,53.3 60.83,54.06 68.45,54.06 | IC4.5 11.04,44.67 11.04,43.9 IC4.6 11.81,43.4 12.82,43.4 12.82,37.05 F1.2 | IC4.4 11.04,45.94 11.04,45.17 IC4.5 | IC5.3 28.57,27.14 29.33,27.9 29.33,28.66 JTAG.4 | v10.54,62.19 9.52,62.19 IC8.6 | IC8.4 9.52,63.46 10.28,63.46 10.28,62.45 v10.54,62.19 | v9.52,67.02 9.52,69.81 ISP_48.2
  Top 0.813: v68.45,48.22 68.45,54.06 C11.+
  Bottom 0.254: R16.2 68.7,8.85 64.64,8.85 R17.2 63.62,9.36 59.56,13.42 41.27,13.42 | R15.2 13.84,8.85 15.36,8.85 R18.2 16.38,8.34 19.93,8.34 21.46,6.82 33.14,6.82 36.19,9.87 36.19,11.9 38.73,11.9 ISP.2 40.51,13.42 41.27,13.42 | v30.09,48.73 29.59,49.24 29.59,49.75 IC2.21 29.59,50.76 29.59,51.52 22.47,51.52 v22.22,51.78 | v58.54,35.52 58.03,35.52 58.03,36.79 C25.2 | C15.2 53.21,42.63 53.21,44.16 | 57.02,48.22 C27.2 | C16.1 51.68,48.48 54.22,48.48 54.48,48.22 | C24.1 55.75,50.25 55.75,48.22 | C26.1 56.76,41.87 54.48,44.16 | IC2.64 26.54,34 26.54,31.2 | IC2.52 35.94,34 35.94,31.2 | 46.86,31.2 v46.86,31.46 | 54.48,45.94 v54.22,45.94 | 41.27,13.42 41.27,23.84 29.84,23.84 29.08,23.08 IC5.3 | v10.54,62.19 12.82,62.19 C37.1 12.82,62.7 9.52,62.7 v9.52,67.02
  Bottom 0.813: C11.+ 68.7,54.83 | 68.7,54.83 IC3.OUT | 68.7,54.83 C13.1 | v68.45,48.22 57.02,48.22 55.75,48.22 54.48,48.22 54.48,45.94 54.48,44.16 53.21,44.16 49.4,44.16 49.4,31.2 46.86,31.2 35.94,31.2 29.84,31.2 | JTAG.4 29.84,31.2 | 29.84,31.2 26.54,31.2 24.25,31.2 R3.2 14.35,31.12 14.35,35.85 F1.2